# EAGLE design Stearns2 (EAGLE 6.6.0)
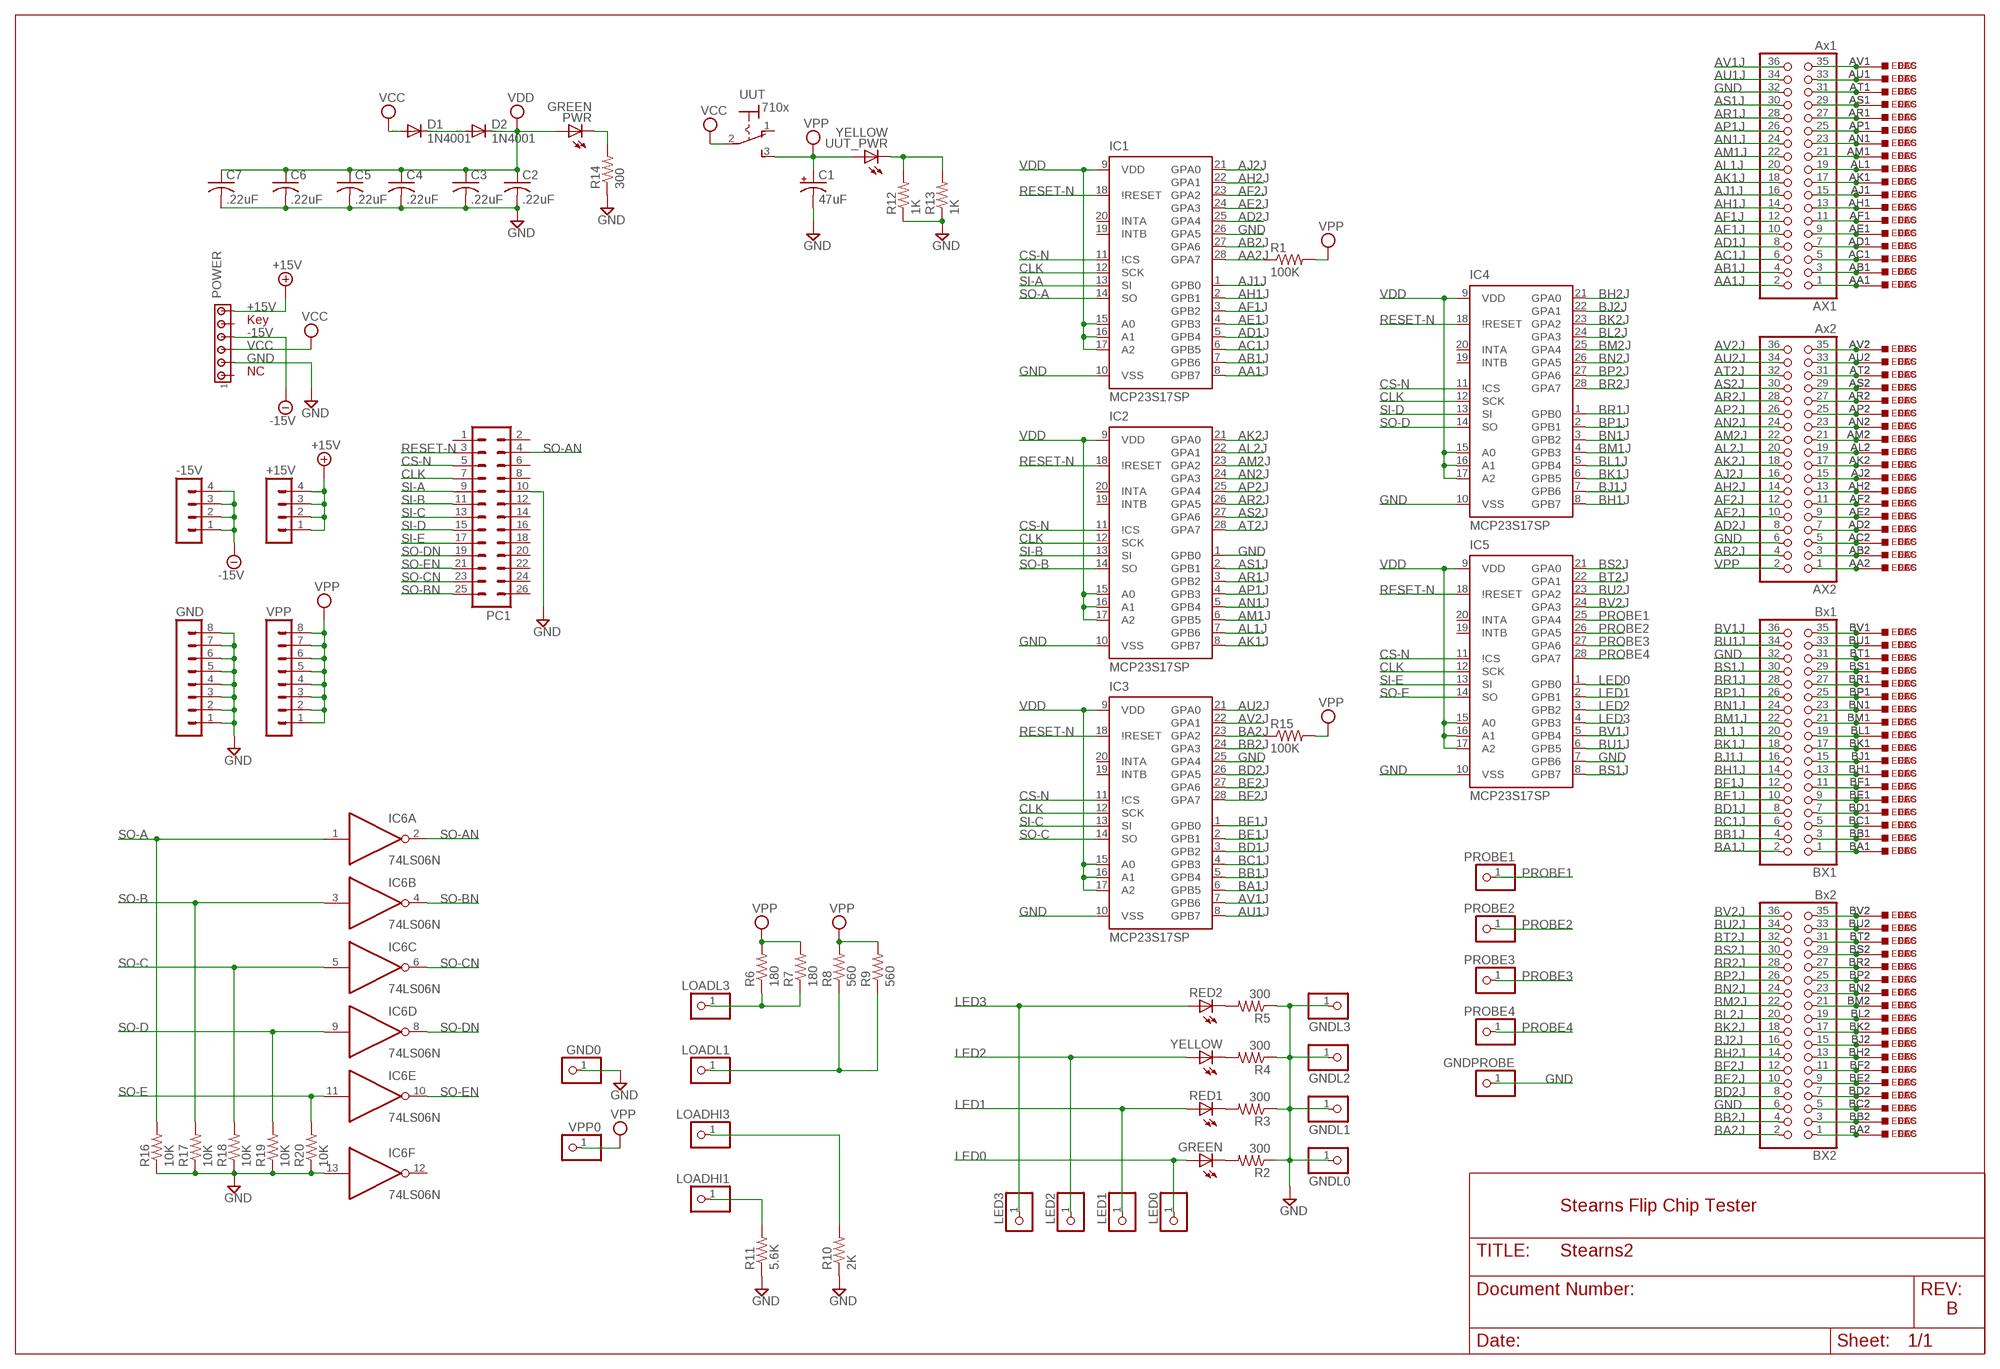
[diagram p0: schematic, sheet 1]

## Parts
+15V  MA04-1  [MA04-1]
-15V  MA04-1  [MA04-1]
AX1  Ax1  PINHD-2X18  [2X18]
AX2  Ax2  PINHD-2X18  [2X18]
BX1  Bx1  PINHD-2X18  [2X18]
BX2  Bx2  PINHD-2X18  [2X18]
C1  47uF  CPOL-USE5-8.5  [E5-8,5]
C2  .22uF  C-US050-025X075  [C050-025X075]
C3  .22uF  C-US050-025X075  [C050-025X075]
C4  .22uF  C-US050-025X075  [C050-025X075]
C5  .22uF  C-US050-025X075  [C050-025X075]
C6  .22uF  C-US050-025X075  [C050-025X075]
C7  .22uF  C-US050-025X075  [C050-025X075]
D1  1N4001  1N4004  [DO41-10]
D2  1N4001  1N4004  [DO41-10]
DEC  W971  [H807-2]
ECS  W971ECS  [ECS2418-2]
EDAC  W971EDAC  [EDAC346-36-2]
GND  MA08-1  [MA08-1]
GND0  PINHD-1X1  [1X01]
GNDL0  PINHD-1X1  [1X01]
GNDL1  PINHD-1X1  [1X01]
GNDL2  PINHD-1X1  [1X01]
GNDL3  PINHD-1X1  [1X01]
GNDPROBE  PINHD-1X1  [1X01]
GREEN  LED5MM  [LED5MM]
IC1  MCP23S17SP  [DIL28-3]
IC2  MCP23S17SP  [DIL28-3]
IC3  MCP23S17SP  [DIL28-3]
IC4  MCP23S17SP  [DIL28-3]
IC5  MCP23S17SP  [DIL28-3]
IC6  74LS06N  [DIL14]
LED0  PINHD-1X1  [1X01]
LED1  PINHD-1X1  [1X01]
LED2  PINHD-1X1  [1X01]
LED3  PINHD-1X1  [1X01]
LOADHI1  PINHD-1X1  [1X01]
LOADHI3  PINHD-1X1  [1X01]
LOADL1  PINHD-1X1  [1X01]
LOADL3  PINHD-1X1  [1X01]
PC1  MA13-2  [MA13-2]
POWER  MTA06-156  [1X6MTA]
PROBE1  PINHD-1X1  [1X01]
PROBE2  PINHD-1X1  [1X01]
PROBE3  PINHD-1X1  [1X01]
PROBE4  PINHD-1X1  [1X01]
PWR  GREEN  LED5MM  [LED5MM]
R1  100K  R-US_0207/10  [0207/10]
R2  300  R-US_0207/10  [0207/10]
R3  300  R-US_0207/10  [0207/10]
R4  300  R-US_0207/10  [0207/10]
R5  300  R-US_0207/10  [0207/10]
R6  180  R-US_0207/10  [0207/10]
R7  180  R-US_0207/10  [0207/10]
R8  560  R-US_0207/10  [0207/10]
R9  560  R-US_0207/10  [0207/10]
R10  2K  R-US_0207/10  [0207/10]
R11  5.6K  R-US_0207/10  [0207/10]
R12  1K  R-US_0207/10  [0207/10]
R13  1K  R-US_0207/10  [0207/10]
R14  300  R-US_0207/10  [0207/10]
R15  100K  R-US_0207/10  [0207/10]
R16  10K  R-US_0207/10  [0207/10]
R17  10K  R-US_0207/10  [0207/10]
R18  10K  R-US_0207/10  [0207/10]
R19  10K  R-US_0207/10  [0207/10]
R20  10K  R-US_0207/10  [0207/10]
RED1  LED5MM  [LED5MM]
RED2  LED5MM  [LED5MM]
UUT  710x  710X  [7109MD9V3]
UUT_PWR  YELLOW  LED5MM  [LED5MM]
VPP  MA08-1  [MA08-1]
VPP0  PINHD-1X1  [1X01]
YELLOW  LED5MM  [LED5MM]

## Nets
+15V [Supply]: +15V.1 +15V.2 +15V.3 +15V.4 POWER.6
-15V [Supply]: -15V.1 -15V.2 -15V.3 -15V.4 POWER.4
AA1J: AX1.2 IC1.8(GPB7)
AA2J: IC1.28(GPA7) R1.1
AB1J: AX1.4 IC1.7(GPB6)
AB2J: AX2.4 IC1.27(GPA6)
AC1J: AX1.6 IC1.6(GPB5)
AD1J: AX1.8 IC1.5(GPB4)
AD2J: AX2.8 IC1.25(GPA4)
AE1J: AX1.10 IC1.4(GPB3)
AE2J: AX2.10 IC1.24(GPA3)
AF1J: AX1.12 IC1.3(GPB2)
AF2J: AX2.12 IC1.23(GPA2)
AH1J: AX1.14 IC1.2(GPB1)
AH2J: AX2.14 IC1.22(GPA1)
AJ1J: AX1.16 IC1.1(GPB0)
AJ2J: AX2.16 IC1.21(GPA0)
AK1J: AX1.18 IC2.8(GPB7)
AK2J: AX2.18 IC2.21(GPA0)
AL1J: AX1.20 IC2.7(GPB6)
AL2J: AX2.20 IC2.22(GPA1)
AM1J: AX1.22 IC2.6(GPB5)
AM2J: AX2.22 IC2.23(GPA2)
AN1J: AX1.24 IC2.5(GPB4)
AN2J: AX2.24 IC2.24(GPA3)
AP1J: AX1.26 IC2.4(GPB3)
AP2J: AX2.26 IC2.25(GPA4)
AR1J: AX1.28 IC2.3(GPB2)
AR2J: AX2.28 IC2.26(GPA5)
AS1J: AX1.30 IC2.2(GPB1)
AS2J: AX2.30 IC2.27(GPA6)
AT2J: AX2.32 IC2.28(GPA7)
AU1J: AX1.34 IC3.8(GPB7)
AU2J: AX2.34 IC3.21(GPA0)
AV1J: AX1.36 IC3.7(GPB6)
AV2J: AX2.36 IC3.22(GPA1)
BA1J: BX1.2 IC3.6(GPB5)
BA2J [Supply]: BX2.2 IC3.23(GPA2) R15.1
BB1J: BX1.4 IC3.5(GPB4)
BB2J: BX2.4 IC3.24(GPA3)
BC1J: BX1.6 IC3.4(GPB3)
BD1J: BX1.8 IC3.3(GPB2)
BD2J: BX2.8 IC3.26(GPA5)
BE1J: BX1.10 IC3.2(GPB1)
BE2J: BX2.10 IC3.27(GPA6)
BF1J: BX1.12 IC3.1(GPB0)
BF2J: BX2.12 IC3.28(GPA7)
BH1J: BX1.14 IC4.8(GPB7)
BH2J: BX2.14 IC4.21(GPA0)
BJ1J: BX1.16 IC4.7(GPB6)
BJ2J: BX2.16 IC4.22(GPA1)
BK1J: BX1.18 IC4.6(GPB5)
BK2J: BX2.18 IC4.23(GPA2)
BL1J: BX1.20 IC4.5(GPB4)
BL2J: BX2.20 IC4.24(GPA3)
BM1J: BX1.22 IC4.4(GPB3)
BM2J: BX2.22 IC4.25(GPA4)
BN1J: BX1.24 IC4.3(GPB2)
BN2J: BX2.24 IC4.26(GPA5)
BP1J: BX1.26 IC4.2(GPB1)
BP2J: BX2.26 IC4.27(GPA6)
BR1J: BX1.28 IC4.1(GPB0)
BR2J: BX2.28 IC4.28(GPA7)
BS1J: BX1.30 IC5.8(GPB7)
BS2J: BX2.30 IC5.21(GPA0)
BT2J: BX2.32 IC5.22(GPA1)
BU1J: BX1.34 IC5.6(GPB5)
BU2J: BX2.34 IC5.23(GPA2)
BV1J: BX1.36 IC5.5(GPB4)
BV2J: BX2.36 IC5.24(GPA3)
CLK: IC1.12(SCK) IC2.12(SCK) IC3.12(SCK) IC4.12(SCK) IC5.12(SCK) PC1.7
CS-N: IC1.11(\!CS) IC2.11(\!CS) IC3.11(\!CS) IC4.11(\!CS) IC5.11(\!CS) PC1.5
GND [Supply]: AX1.32 AX2.6 BX1.32 BX2.6 C1.- C2.2 C3.2 C4.2 C5.2 C6.2 C7.2 GND0.1 GND.1 GND.2 GND.3 GND.4 GND.5 GND.6 GND.7 GND.8 GNDL0.1 GNDL1.1 GNDL2.1 GNDL3.1 GNDPROBE.1 IC1.10(VSS) IC1.26(GPA5) IC2.1(GPB0) IC2.10(VSS) IC3.10(VSS) IC3.25(GPA4) IC4.10(VSS) IC5.7(GPB6) IC5.10(VSS) IC6.13(F:I) PC1.10 POWER.2 R2.1 R3.1 R4.1 R5.1 R10.1 R11.1 R12.1 R13.1 R14.1 R16.1 R17.1 R18.1 R19.1 R20.1
LED0: GREEN.A IC5.1(GPB0) LED0.1
LED1: IC5.2(GPB1) LED1.1 RED1.A
LED2: IC5.3(GPB2) LED2.1 YELLOW.A
LED3: IC5.4(GPB3) LED3.1 RED2.A
N$1: AX1.1 DEC.AA1 ECS.AA1 EDAC.AA1
N$2: AX1.35 DEC.AV1 ECS.AV1 EDAC.AV1
N$3: AX1.33 DEC.AU1 ECS.AU1 EDAC.AU1
N$4: AX1.31 DEC.AT1 ECS.AT1 EDAC.AT1
N$5: AX1.29 DEC.AS1 ECS.AS1 EDAC.AS1
N$6: AX1.27 DEC.AR1 ECS.AR1 EDAC.AR1
N$7: AX1.25 DEC.AP1 ECS.AP1 EDAC.AP1
N$8: AX1.23 DEC.AN1 ECS.AN1 EDAC.AN1
N$9: AX1.21 DEC.AM1 ECS.AM1 EDAC.AM1
N$10: AX1.19 DEC.AL1 ECS.AL1 EDAC.AL1
N$11: AX1.17 DEC.AK1 ECS.AK1 EDAC.AK1
N$12: AX1.15 DEC.AJ1 ECS.AJ1 EDAC.AJ1
N$13: AX1.13 DEC.AH1 ECS.AH1 EDAC.AH1
N$14: AX1.11 DEC.AF1 ECS.AF1 EDAC.AF1
N$15: AX1.9 DEC.AE1 ECS.AE1 EDAC.AE1
N$16: AX1.7 DEC.AD1 ECS.AD1 EDAC.AD1
N$17: AX1.5 DEC.AC1 ECS.AC1 EDAC.AC1
N$18: AX1.3 DEC.AB1 ECS.AB1 EDAC.AB1
N$19: AX2.1 DEC.AA2 ECS.AA2 EDAC.AA2
N$20: AX2.3 DEC.AB2 ECS.AB2 EDAC.AB2
N$21: AX2.5 DEC.AC2 ECS.AC2 EDAC.AC2
N$22: AX2.7 DEC.AD2 ECS.AD2 EDAC.AD2
N$23: AX2.9 DEC.AE2 ECS.AE2 EDAC.AE2
N$24: AX2.11 DEC.AF2 ECS.AF2 EDAC.AF2
N$25: AX2.13 DEC.AH2 ECS.AH2 EDAC.AH2
N$26: AX2.15 DEC.AJ2 ECS.AJ2 EDAC.AJ2
N$27: AX2.17 DEC.AK2 ECS.AK2 EDAC.AK2
N$28: AX2.19 DEC.AL2 ECS.AL2 EDAC.AL2
N$29: AX2.21 DEC.AM2 ECS.AM2 EDAC.AM2
N$30: AX2.23 DEC.AN2 ECS.AN2 EDAC.AN2
N$31: AX2.25 DEC.AP2 ECS.AP2 EDAC.AP2
N$32: AX2.27 DEC.AR2 ECS.AR2 EDAC.AR2
N$33: AX2.29 DEC.AS2 ECS.AS2 EDAC.AS2
N$34: AX2.31 DEC.AT2 ECS.AT2 EDAC.AT2
N$35: AX2.33 DEC.AU2 ECS.AU2 EDAC.AU2
N$36: AX2.35 DEC.AV2 ECS.AV2 EDAC.AV2
N$37: BX2.1 DEC.BA2 ECS.BA2 EDAC.BA2
N$38: BX2.3 DEC.BB2 ECS.BB2 EDAC.BB2
N$39: BX2.5 DEC.BC2 ECS.BC2 EDAC.BC2
N$40: BX2.7 DEC.BD2 ECS.BD2 EDAC.BD2
N$41: BX2.9 DEC.BE2 ECS.BE2 EDAC.BE2
N$42: BX2.11 DEC.BF2 ECS.BF2 EDAC.BF2
N$43: BX2.13 DEC.BH2 ECS.BH2 EDAC.BH2
N$44: BX2.15 DEC.BJ2 ECS.BJ2 EDAC.BJ2
N$45: BX2.17 DEC.BK2 ECS.BK2 EDAC.BK2
N$46: BX2.19 DEC.BL2 ECS.BL2 EDAC.BL2
N$47: BX2.21 DEC.BM2 ECS.BM2 EDAC.BM2
N$48: BX2.23 DEC.BN2 ECS.BN2 EDAC.BN2
N$49: BX2.25 DEC.BP2 ECS.BP2 EDAC.BP2
N$50: BX2.27 DEC.BR2 ECS.BR2 EDAC.BR2
N$51: BX2.29 DEC.BS2 ECS.BS2 EDAC.BS2
N$52: BX2.31 DEC.BT2 ECS.BT2 EDAC.BT2
N$53: BX2.33 DEC.BU2 ECS.BU2 EDAC.BU2
N$54: BX2.35 DEC.BV2 ECS.BV2 EDAC.BV2
N$55: BX1.1 DEC.BA1 ECS.BA1 EDAC.BA1
N$56: BX1.3 DEC.BB1 ECS.BB1 EDAC.BB1
N$57: BX1.5 DEC.BC1 ECS.BC1 EDAC.BC1
N$58: BX1.7 DEC.BD1 ECS.BD1 EDAC.BD1
N$59: BX1.9 DEC.BE1 ECS.BE1 EDAC.BE1
N$60: BX1.11 DEC.BF1 ECS.BF1 EDAC.BF1
N$61: BX1.13 DEC.BH1 ECS.BH1 EDAC.BH1
N$62: BX1.15 DEC.BJ1 ECS.BJ1 EDAC.BJ1
N$63: BX1.17 DEC.BK1 ECS.BK1 EDAC.BK1
N$64: BX1.19 DEC.BL1 ECS.BL1 EDAC.BL1
N$65: BX1.21 DEC.BM1 ECS.BM1 EDAC.BM1
N$66: BX1.23 DEC.BN1 ECS.BN1 EDAC.BN1
N$67: BX1.25 DEC.BP1 ECS.BP1 EDAC.BP1
N$68: BX1.27 DEC.BR1 ECS.BR1 EDAC.BR1
N$69: BX1.29 DEC.BS1 ECS.BS1 EDAC.BS1
N$70: BX1.31 DEC.BT1 ECS.BT1 EDAC.BT1
N$71: BX1.33 DEC.BU1 ECS.BU1 EDAC.BU1
N$72: BX1.35 DEC.BV1 ECS.BV1 EDAC.BV1
N$73: GREEN.K(C) R2.2
N$74: R3.2 RED1.K(C)
N$75: R4.2 YELLOW.K(C)
N$76: R5.2 RED2.K(C)
N$77: LOADL3.1 R6.1 R7.1
N$78: LOADL1.1 R8.1 R9.1
N$79: LOADHI1.1 R11.2
N$80: LOADHI3.1 R10.2
N$81: D1.C D2.A
N$82: R12.2 R13.2 UUT_PWR.K(C)
N$83: PWR.K(C) R14.2
PROBE1: IC5.25(GPA4) PROBE1.1
PROBE2: IC5.26(GPA5) PROBE2.1
PROBE3: IC5.27(GPA6) PROBE3.1
PROBE4: IC5.28(GPA7) PROBE4.1
RESET-N: IC1.18(\!RESET) IC2.18(\!RESET) IC3.18(\!RESET) IC4.18(\!RESET) IC5.18(\!RESET) PC1.3
SI-A: IC1.13(SI) PC1.9
SI-B: IC2.13(SI) PC1.11
SI-C: IC3.13(SI) PC1.13
SI-D: IC4.13(SI) PC1.15
SI-E: IC5.13(SI) PC1.17
SO-A: IC1.14(SO) IC6.1(A:I) R16.2
SO-AN: IC6.2(A:O) PC1.4
SO-B: IC2.14(SO) IC6.3(B:I) R17.2
SO-BN: IC6.4(B:O) PC1.25
SO-C: IC3.14(SO) IC6.5(C:I) R18.2
SO-CN: IC6.6(C:O) PC1.23
SO-D: IC4.14(SO) IC6.9(D:I) R19.2
SO-DN: IC6.8(D:O) PC1.19
SO-E: IC5.14(SO) IC6.11(E:I) R20.2
SO-EN: IC6.10(E:O) PC1.21
VCC [Supply]: D1.A POWER.3 UUT.2(P)
VDD [Supply]: C2.1 C3.1 C4.1 C5.1 C6.1 C7.1 D2.C IC1.9(VDD) IC1.15(A0) IC1.16(A1) IC1.17(A2) IC2.9(VDD) IC2.15(A0) IC2.16(A1) IC2.17(A2) IC3.9(VDD) IC3.15(A0) IC3.16(A1) IC3.17(A2) IC4.9(VDD) IC4.15(A0) IC4.16(A1) IC4.17(A2) IC5.9(VDD) IC5.15(A0) IC5.16(A1) IC5.17(A2) PWR.A
VPP [Supply]: AX2.2 C1.+ R1.2 R6.2 R7.2 R8.2 R9.2 R15.2 UUT.3(S) UUT_PWR.A VPP0.1 VPP.1 VPP.2 VPP.3 VPP.4 VPP.5 VPP.6 VPP.7 VPP.8
Unconnected: IC1.19(INTB) IC1.20(INTA) IC2.19(INTB) IC2.20(INTA) IC3.19(INTB) IC3.20(INTA) IC4.19(INTB) IC4.20(INTA) IC5.19(INTB) IC5.20(INTA) IC6.12(F:O) PC1.1 PC1.2 PC1.6 PC1.8 PC1.12 PC1.14 PC1.16 PC1.18 PC1.20 PC1.22 PC1.24 PC1.26 POWER.1 POWER.5 UUT.1(O)

## Notes on the sheet
- Key
- NC
- Stearns Flip Chip Tester
- B

## Power pins joined to a net without a drawn wire
GND: IC6.7(P:GND) UUT.NC@1(GND) UUT.NC@2(GND) UUT.NC@3(GND) UUT.NC@4(GND) UUT.NC@5(GND) UUT.NC@6(GND) UUT.NC@7(GND) UUT.NC@8(GND)
VCC: IC6.14(P:VCC)

## Library data of the parts
+15V -15V = con-lstb:MA04-1: PIN HEADER; OC_FARNELL: unknown; OC_NEWARK: unknown
AX1 AX2 BX1 BX2 = pinhead:PINHD-2X18: PIN HEADER
C1 = rcl:CPOL-US: POLARIZED CAPACITOR, American symbol
C2-C7 = rcl:C-US: CAPACITOR, American symbol
D1 D2 = diode:1N4004: DIODE general purpose rectifier, 1 A
DEC ECS EDAC = dec-m:W971: Double sided Double Height Connector, 72 pins
GND VPP = con-lstb:MA08-1: PIN HEADER; OC_FARNELL: unknown; OC_NEWARK: unknown
GND0 GNDL0 GNDL1-GNDL3 GNDPROBE LED0 LED1-LED3 LOADHI1 LOADHI3 LOADL1 LOADL3 PROBE1-PROBE4 VPP0 = pinhead:PINHD-1X1: PIN HEADER
GREEN PWR RED1 RED2 UUT_PWR YELLOW = led:LED: LED OSRAM: - CHIPLED LG R971, LG N971, LY N971, LG Q971, LY Q971, LO R971, LY R971 LH N974, LH R974 LS Q976, LO Q976, LY Q976 LO Q996 - Hyper CHIPLED LW Q18S LB Q993, LB Q99A, LB R99A - SideLED LS A670, LO A670, LY A670, LG A670, LP A670 LB A673, LV A673, LT A673, LW A673 LH A674 LY A675 LS A676, LA A676, LO A676, LY A676, LW A676 LS A679, LY A679, LG A679 - Hyper Micro SIDELED® LS Y876, LA Y876, LO Y876, LY Y876 LT Y87S - SmartLED LW L88C, LW L88S LB L89C, LB L89S, LG L890 LS L89K, LO L89K, LY L89K LS L896, LA L896, LO L896, LY L896 - TOPLED LS T670, LO T670, LY T670, LG T670, LP T670 LSG T670, LSP T670, LSY T670, LOP T670, LYG T670 LG T671, LOG T671, LSG T671 LB T673, LV T673, LT T673, LW T673 LH T674 LS T676, LA T676, LO T676, LY T676, LB T676, LH T676, LSB T676, LW T676 LB T67C, LV T67C, LT T67C, LS T67K, LO T67K, LY T67K, LW E67C LS E67B, LA E67B, LO E67B, LY E67B, LB E67C, LV E67C, LT E67C LW T67C LS T679, LY T679, LG T679 LS T770, LO T770, LY T770, LG T770, LP T770 LB T773, LV T773, LT T773, LW T773 LH T774 LS E675, LA E675, LY E675, LS T675 LS T776, LA T776, LO T776, LY T776, LB T776 LHGB T686 LT T68C, LB T68C - Hyper Mini TOPLED® LB M676 - Mini TOPLED Santana® LG M470 LS M47K, LO M47K, LY M47K Source: http://www.osram.convergy.de LUXEON: - LUMILED® LXK2-PW12-R00, LXK2-PW12-S00, LXK2-PW14-U00, LXK2-PW14-V00 LXK2-PM12-R00, LXK2-PM12-S00, LXK2-PM14-U00 LXK2-PE12-Q00, LXK2-PE12-R00, LXK2-PE12-S00, LXK2-PE14-T00, LXK2-PE14-U00 LXK2-PB12-K00, LXK2-PB12-L00, LXK2-PB12-M00, LXK2-PB14-N00, LXK2-PB14-P00, LXK2-PB14-Q00 LXK2-PR12-L00, LXK2-PR12-M00, LXK2-PR14-Q00, LXK2-PR14-R00 LXK2-PD12-Q00, LXK2-PD12-R00, LXK2-PD12-S00 LXK2-PH12-R00, LXK2-PH12-S00 LXK2-PL12-P00, LXK2-PL12-Q00, LXK2-PL12-R00 Source: www.luxeon.com KINGBRIGHT: KA-3528ASYC Source: www.kingbright.com
IC1-IC5 = MCP23S17:MCP23S17: http://ww1.microchip.com/downloads/en/DeviceDoc/21952a.pdf Source: http://ww1.microchip.com/downloads/en/DeviceDoc/21952a.pdf
IC6 = 74xx-us:74*06: Hex INVERTER, open collector high-voltage output
PC1 = con-lstb:MA13-2: PIN HEADER; OC_FARNELL: unknown; OC_NEWARK: unknown
POWER = con-amp:MTA06-156: AMP connector
R1-R20 = rcl:R-US_: RESISTOR, American symbol
UUT = dec-con:710X: 710x with optional V2 or V3 mounting bracket.

## Net classes
1 Supply: width 0.813 mm

## Board
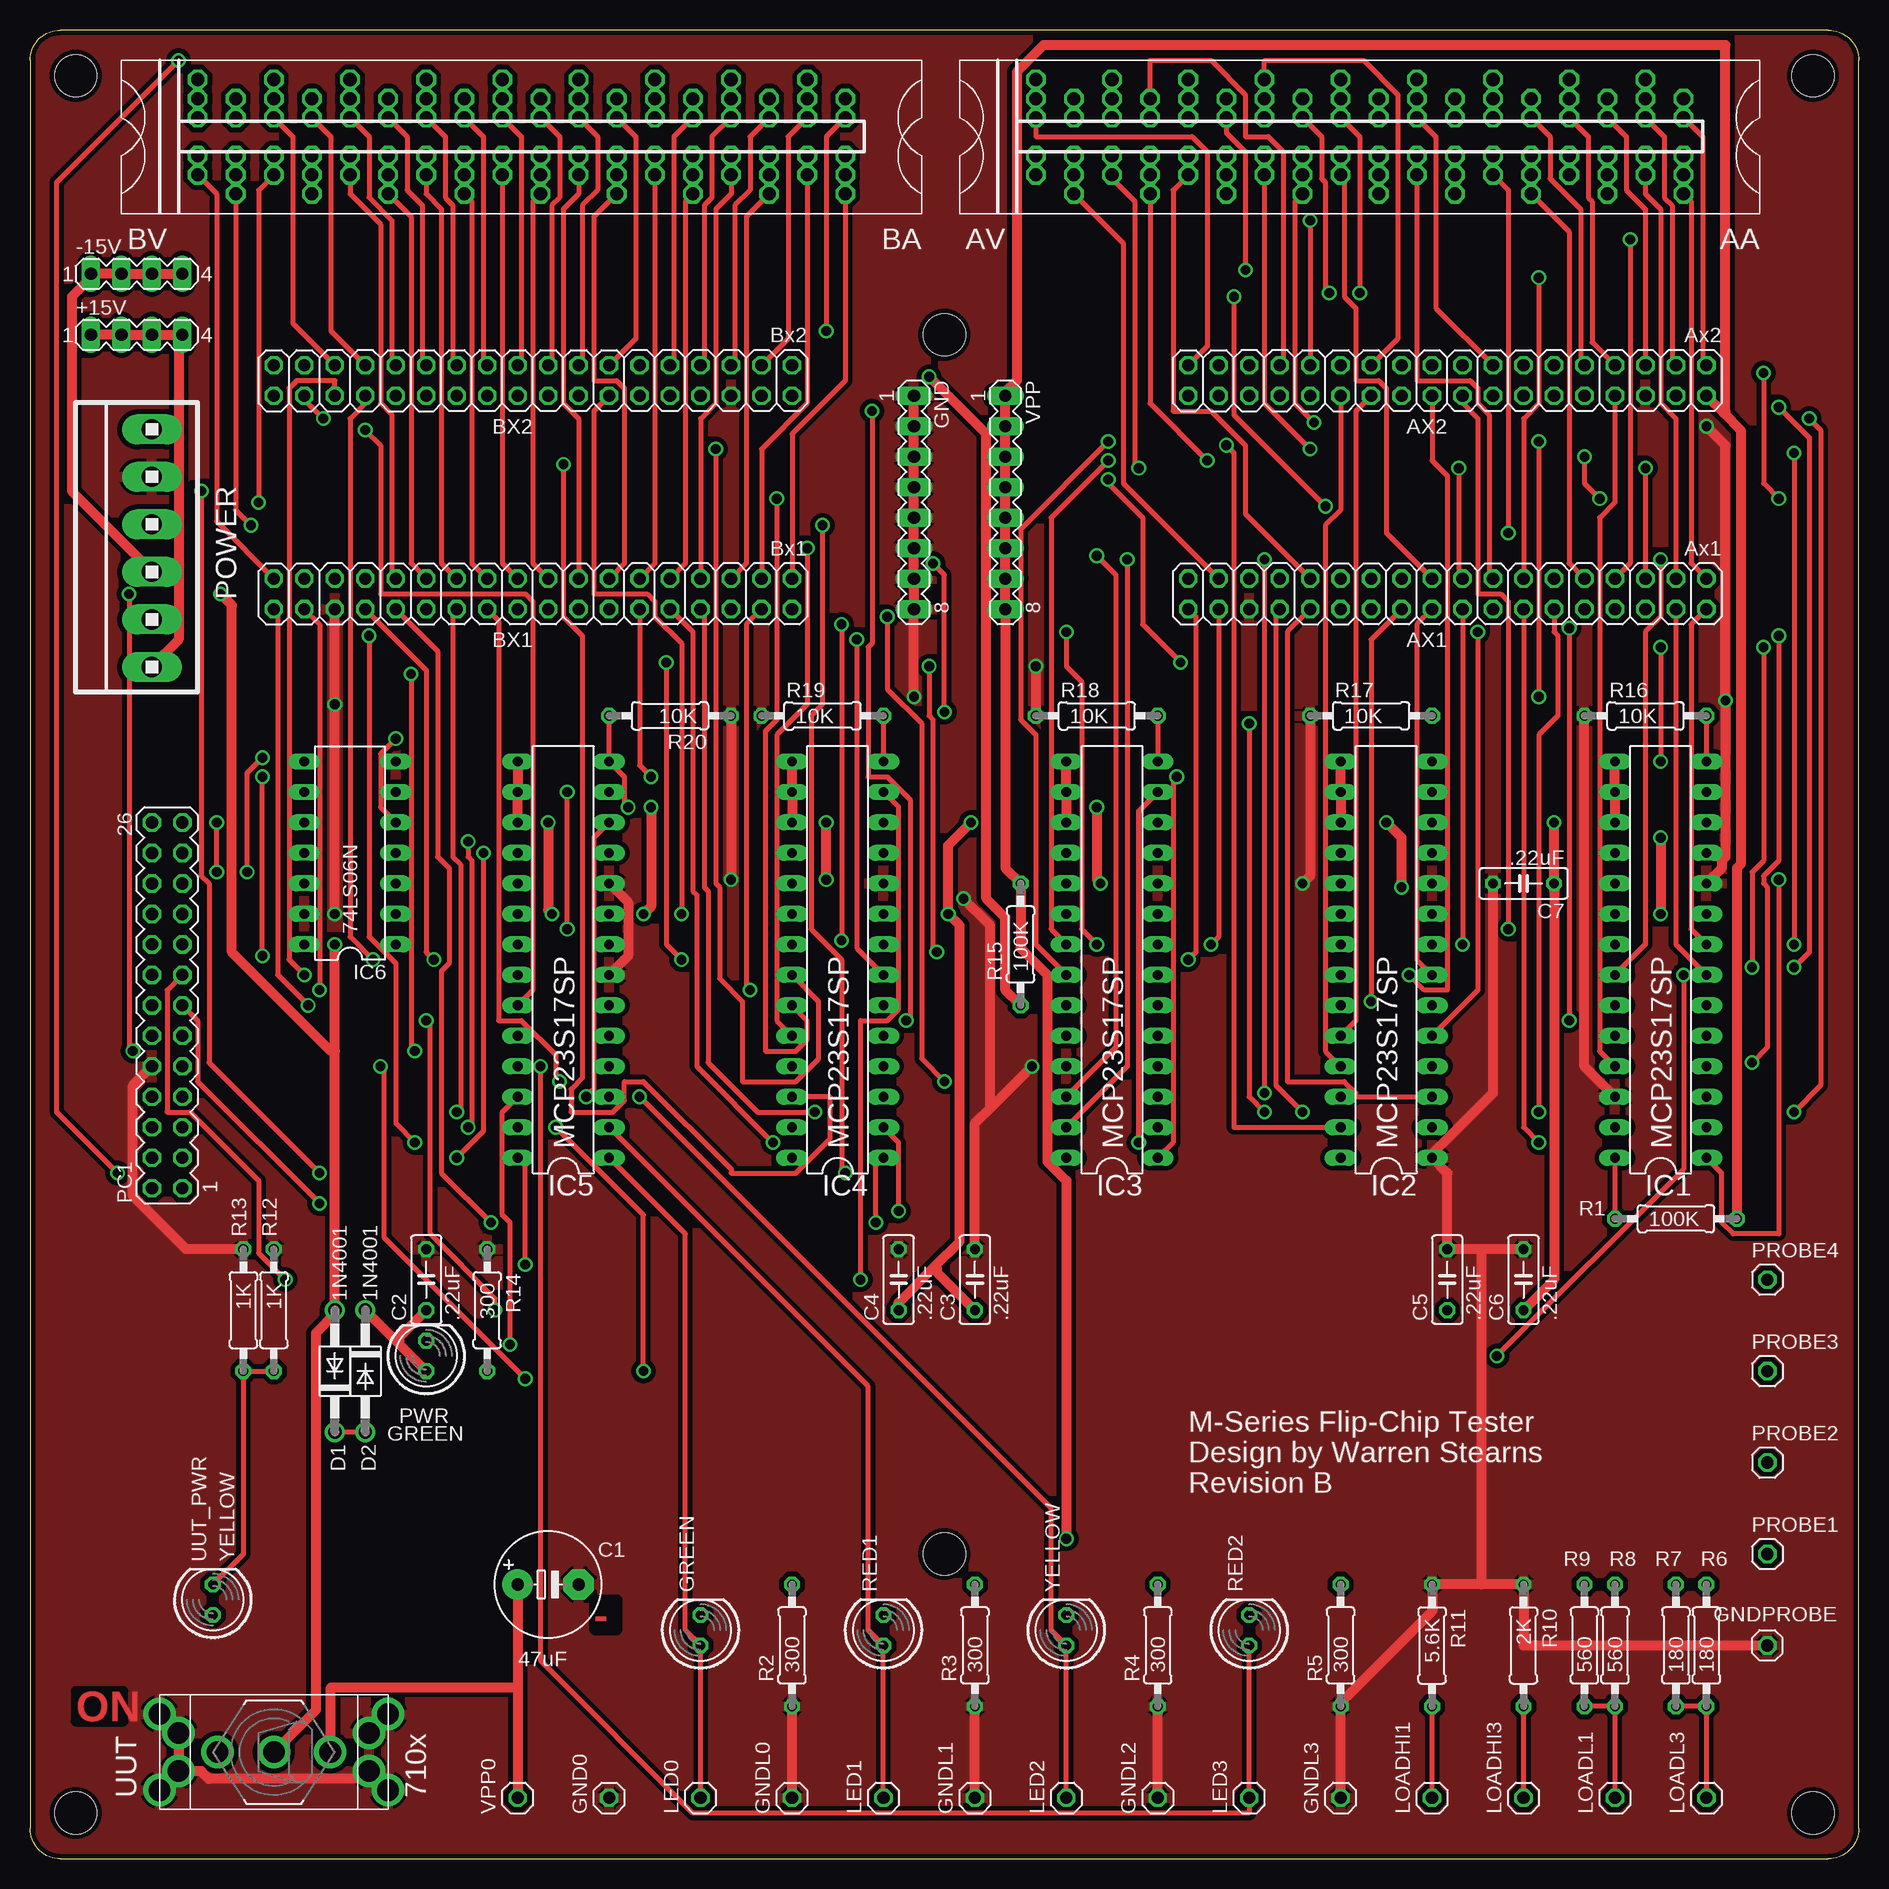
[diagram p1: board, top side]
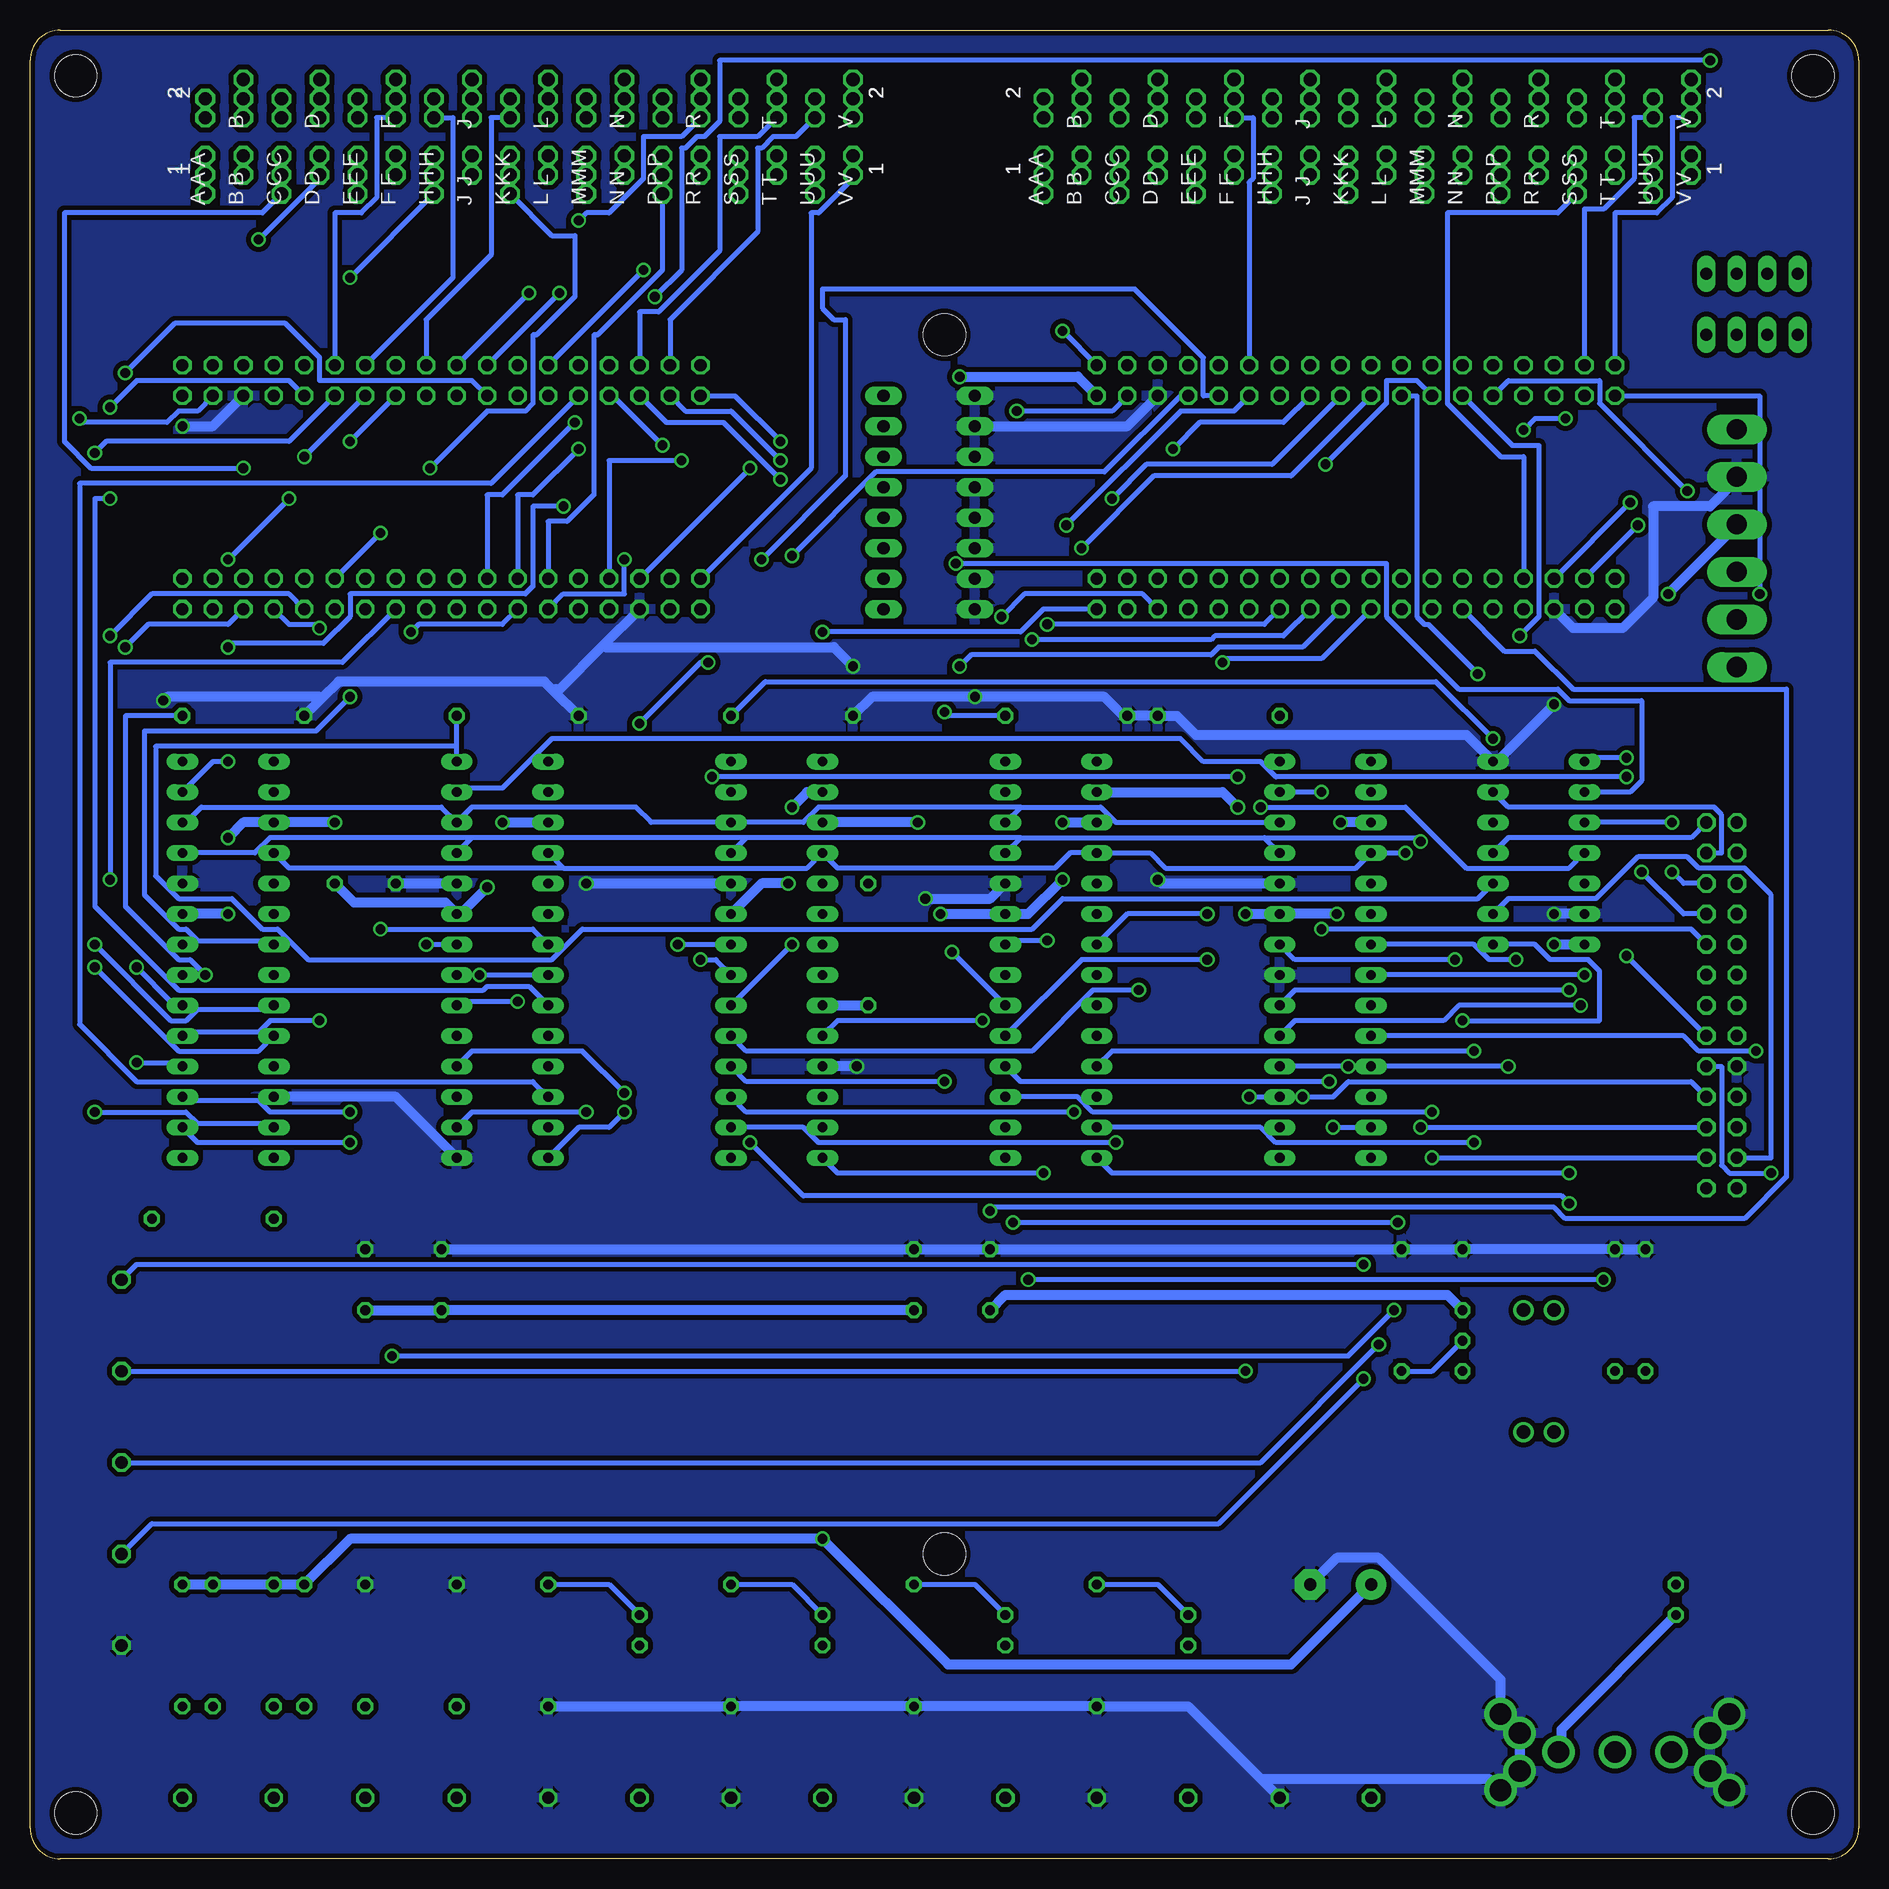
[diagram p2: board, bottom side, seen from below]

Size 152.4 x 152.4 mm. Coordinates in mm from the lower left corner, seen from the top.
Outline: 149.86,152.4 2.54,152.4 arc90 0,149.86 0,2.54 arc90 2.54,0 149.86,0 arc90 152.4,2.54 152.4,149.86 arc90 149.86,152.4
Copper layers (1+16): Top 0.035mm / dielectric 1.5mm / Bottom 0.035mm
Design rules "16mils *": minimum track width 16mil, minimum drill 32mil, track to track 15mil, track to pad 10mil, pad to pad 10mil, via to via 10mil, smd to smd 10mil, copper to edge 13mil, drill to drill 10mil, minimum pad ring 10mil, minimum via ring 8mil, stop-mask expansion 0mil, vias tented up to drill 0mil, thermal gap 10mil
Holes 3.51 mm at 148.59,148.59 3.81,148.59 3.81,3.81 148.59,3.81 76.2,127 76.2,25.4

### Footprints (pad centres in the part's own frame; a part is rotated, then mirrored left to right if it is on the bottom)
MA04-1 = drill 1.016 long: 1 -3.81,0; 2 -1.27,0; 3 1.27,0; 4 3.81,0
2X18 = drill 1.016 octagon: 1 -21.59,-1.27; 2 -21.59,1.27; 3 -19.05,-1.27; 4 -19.05,1.27; 5 -16.51,-1.27; 6 -16.51,1.27; 7 -13.97,-1.27; 8 -13.97,1.27; 9 -11.43,-1.27; 10 -11.43,1.27; 11 -8.89,-1.27; 12 -8.89,1.27; 13 -6.35,-1.27; 14 -6.35,1.27; 15 -3.81,-1.27; 16 -3.81,1.27; 17 -1.27,-1.27; 18 -1.27,1.27; 19 1.27,-1.27; 20 1.27,1.27; 21 3.81,-1.27; 22 3.81,1.27; 23 6.35,-1.27; 24 6.35,1.27; 25 8.89,-1.27; 26 8.89,1.27; 27 11.43,-1.27; 28 11.43,1.27; 29 13.97,-1.27; 30 13.97,1.27; 31 16.51,-1.27; 32 16.51,1.27; 33 19.05,-1.27; 34 19.05,1.27; 35 21.59,-1.27; 36 21.59,1.27
E5-8,5 = drill 1.016 pad 2.54: + -2.54,0 | drill 1.016 pad 2.54 octagon: - 2.54,0
C050-025X075 = drill 0.813 octagon: 1 -2.54,0; 2 2.54,0
DO41-10 = drill 1.118: A 5.08,0; C -5.08,0
H807-2 = drill 1.092 octagon: AA1 4.763,60.325; AA2 -1.587,60.325; AB1 1.587,57.15; AB2 -4.763,57.15; AC1 4.763,53.975; AC2 -1.587,53.975; AD1 1.587,50.8; AD2 -4.763,50.8; AE1 4.763,47.625; AE2 -1.587,47.625; AF1 1.587,44.45; AF2 -4.763,44.45; AH1 4.763,41.275; AH2 -1.587,41.275; AJ1 1.587,38.1; AJ2 -4.763,38.1; AK1 4.763,34.925; AK2 -1.587,34.925; AL1 1.587,31.75; AL2 -4.763,31.75; AM1 4.763,28.575; AM2 -1.587,28.575; AN1 1.587,25.4; AN2 -4.763,25.4; AP1 4.763,22.225; AP2 -1.587,22.225; AR1 1.587,19.05; AR2 -4.763,19.05; AS1 4.763,15.875; AS2 -1.587,15.875; AT1 1.587,12.7; AT2 -4.763,12.7; AU1 4.763,9.525; AU2 -1.587,9.525; AV1 1.587,6.35; AV2 -4.763,6.35; BA1 4.763,-9.525; BA2 -1.587,-9.525; BB1 1.587,-12.7; BB2 -4.763,-12.7; BC1 4.763,-15.875; BC2 -1.587,-15.875; BD1 1.587,-19.05; BD2 -4.763,-19.05; BE1 4.763,-22.225; BE2 -1.587,-22.225; BF1 1.587,-25.4; BF2 -4.763,-25.4; BH1 4.763,-28.575; BH2 -1.587,-28.575; BJ1 1.587,-31.75; BJ2 -4.763,-31.75; BK1 4.763,-34.925; BK2 -1.587,-34.925; BL1 1.587,-38.1; BL2 -4.763,-38.1; BM1 4.763,-41.275; BM2 -1.587,-41.275; BN1 1.587,-44.45; BN2 -4.763,-44.45; BP1 4.763,-47.625; BP2 -1.587,-47.625; BR1 1.587,-50.8; BR2 -4.763,-50.8; BS1 4.763,-53.975; BS2 -1.587,-53.975; BT1 1.587,-57.15; BT2 -4.763,-57.15; BU1 4.763,-60.325; BU2 -1.587,-60.325; BV1 1.587,-63.5; BV2 -4.763,-63.5
ECS2418-2 = drill 1.092 octagon: AA1 1.587,60.325; AA2 -1.587,60.325; AB1 1.587,57.15; AB2 -1.587,57.15; AC1 1.587,53.975; AC2 -1.587,53.975; AD1 1.587,50.8; AD2 -1.587,50.8; AE1 1.587,47.625; AE2 -1.587,47.625; AF1 1.587,44.45; AF2 -1.587,44.45; AH1 1.587,41.275; AH2 -1.587,41.275; AJ1 1.587,38.1; AJ2 -1.587,38.1; AK1 1.587,34.925; AK2 -1.587,34.925; AL1 1.587,31.75; AL2 -1.587,31.75; AM1 1.587,28.575; AM2 -1.587,28.575; AN1 1.587,25.4; AN2 -1.587,25.4; AP1 1.587,22.225; AP2 -1.587,22.225; AR1 1.587,19.05; AR2 -1.587,19.05; AS1 1.587,15.875; AS2 -1.587,15.875; AT1 1.587,12.7; AT2 -1.587,12.7; AU1 1.587,9.525; AU2 -1.587,9.525; AV1 1.587,6.35; AV2 -1.587,6.35; BA1 1.587,-9.525; BA2 -1.587,-9.525; BB1 1.587,-12.7; BB2 -1.587,-12.7; BC1 1.587,-15.875; BC2 -1.587,-15.875; BD1 1.587,-19.05; BD2 -1.587,-19.05; BE1 1.587,-22.225; BE2 -1.587,-22.225; BF1 1.587,-25.4; BF2 -1.587,-25.4; BH1 1.587,-28.575; BH2 -1.587,-28.575; BJ1 1.587,-31.75; BJ2 -1.587,-31.75; BK1 1.587,-34.925; BK2 -1.587,-34.925; BL1 1.587,-38.1; BL2 -1.587,-38.1; BM1 1.587,-41.275; BM2 -1.587,-41.275; BN1 1.587,-44.45; BN2 -1.587,-44.45; BP1 1.587,-47.625; BP2 -1.587,-47.625; BR1 1.587,-50.8; BR2 -1.587,-50.8; BS1 1.587,-53.975; BS2 -1.587,-53.975; BT1 1.587,-57.15; BT2 -1.587,-57.15; BU1 1.587,-60.325; BU2 -1.587,-60.325; BV1 1.587,-63.5; BV2 -1.587,-63.5
EDAC346-36-2 = drill 1.092 octagon: AA1 3.175,60.325; AA2 -3.175,60.325; AB1 3.175,57.15; AB2 -3.175,57.15; AC1 3.175,53.975; AC2 -3.175,53.975; AD1 3.175,50.8; AD2 -3.175,50.8; AE1 3.175,47.625; AE2 -3.175,47.625; AF1 3.175,44.45; AF2 -3.175,44.45; AH1 3.175,41.275; AH2 -3.175,41.275; AJ1 3.175,38.1; AJ2 -3.175,38.1; AK1 3.175,34.925; AK2 -3.175,34.925; AL1 3.175,31.75; AL2 -3.175,31.75; AM1 3.175,28.575; AM2 -3.175,28.575; AN1 3.175,25.4; AN2 -3.175,25.4; AP1 3.175,22.225; AP2 -3.175,22.225; AR1 3.175,19.05; AR2 -3.175,19.05; AS1 3.175,15.875; AS2 -3.175,15.875; AT1 3.175,12.7; AT2 -3.175,12.7; AU1 3.175,9.525; AU2 -3.175,9.525; AV1 3.175,6.35; AV2 -3.175,6.35; BA1 3.175,-9.525; BA2 -3.175,-9.525; BB1 3.175,-12.7; BB2 -3.175,-12.7; BC1 3.175,-15.875; BC2 -3.175,-15.875; BD1 3.175,-19.05; BD2 -3.175,-19.05; BE1 3.175,-22.225; BE2 -3.175,-22.225; BF1 3.175,-25.4; BF2 -3.175,-25.4; BH1 3.175,-28.575; BH2 -3.175,-28.575; BJ1 3.175,-31.75; BJ2 -3.175,-31.75; BK1 3.175,-34.925; BK2 -3.175,-34.925; BL1 3.175,-38.1; BL2 -3.175,-38.1; BM1 3.175,-41.275; BM2 -3.175,-41.275; BN1 3.175,-44.45; BN2 -3.175,-44.45; BP1 3.175,-47.625; BP2 -3.175,-47.625; BR1 3.175,-50.8; BR2 -3.175,-50.8; BS1 3.175,-53.975; BS2 -3.175,-53.975; BT1 3.175,-57.15; BT2 -3.175,-57.15; BU1 3.175,-60.325; BU2 -3.175,-60.325; BV1 3.175,-63.5; BV2 -3.175,-63.5
MA08-1 = drill 1.016 long: 1 -8.89,0; 2 -6.35,0; 3 -3.81,0; 4 -1.27,0; 5 1.27,0; 6 3.81,0; 7 6.35,0; 8 8.89,0
1X01 = drill 1.016 octagon: 1 0,0
LED5MM = drill 0.813 octagon: A -1.27,0; K 1.27,0
DIL28-3 = drill 0.813 long: 1 -16.51,-3.81; 2 -13.97,-3.81; 3 -11.43,-3.81; 4 -8.89,-3.81; 5 -6.35,-3.81; 6 -3.81,-3.81; 7 -1.27,-3.81; 8 1.27,-3.81; 9 3.81,-3.81; 10 6.35,-3.81; 11 8.89,-3.81; 12 11.43,-3.81; 13 13.97,-3.81; 14 16.51,-3.81; 15 16.51,3.81; 16 13.97,3.81; 17 11.43,3.81; 18 8.89,3.81; 19 6.35,3.81; 20 3.81,3.81; 21 1.27,3.81; 22 -1.27,3.81; 23 -3.81,3.81; 24 -6.35,3.81; 25 -8.89,3.81; 26 -11.43,3.81; 27 -13.97,3.81; 28 -16.51,3.81
DIL14 = drill 0.813 long: 1 -7.62,-3.81; 2 -5.08,-3.81; 3 -2.54,-3.81; 4 0,-3.81; 5 2.54,-3.81; 6 5.08,-3.81; 7 7.62,-3.81; 8 7.62,3.81; 9 5.08,3.81; 10 2.54,3.81; 11 0,3.81; 12 -2.54,3.81; 13 -5.08,3.81; 14 -7.62,3.81
MA13-2 = drill 1.016 octagon: 1 -15.24,-1.27; 2 -15.24,1.27; 3 -12.7,-1.27; 4 -12.7,1.27; 5 -10.16,-1.27; 6 -10.16,1.27; 7 -7.62,-1.27; 8 -7.62,1.27; 9 -5.08,-1.27; 10 -5.08,1.27; 11 -2.54,-1.27; 12 -2.54,1.27; 13 0,-1.27; 14 0,1.27; 15 2.54,-1.27; 16 2.54,1.27; 17 5.08,-1.27; 18 5.08,1.27; 19 7.62,-1.27; 20 7.62,1.27; 21 10.16,-1.27; 22 10.16,1.27; 23 12.7,-1.27; 24 12.7,1.27; 25 15.24,-1.27; 26 15.24,1.27
1X6MTA = drill 1.676 long: 1 9.906,0; 2 5.944,0; 3 1.981,0; 4 -1.981,0; 5 -5.944,0; 6 -9.906,0
0207/10 = drill 0.813 octagon: 1 -5.08,0; 2 5.08,0
7109MD9V3 = drill 1.803: 1 0,4.699; 2 0,0; 3 0,-4.699; NC@1 -3.175,9.525; NC@2 -1.587,7.938; NC@3 3.175,9.525; NC@4 1.587,7.938; NC@5 -3.175,-9.525; NC@6 -1.587,-7.938; NC@7 1.587,-7.938; NC@8 3.175,-9.525

### Placement (x,y rotation side)
+15V  8.89,127 0 top
-15V  8.89,132.08 0 top
AX1  118.11,105.41 180 top
AX2  118.11,123.19 180 top
BX1  41.91,105.41 180 top
BX2  41.91,123.19 180 top
C1  43.18,22.86 0 top
C2  33.02,48.26 90 top
C3  78.74,48.26 90 top
C4  72.39,48.26 90 top
C5  118.11,48.26 90 top
C6  124.46,48.26 90 top
C7  124.46,81.28 180 top
D1  25.4,40.64 90 top
D2  27.94,40.64 270 top
DEC  77.47,143.51 270 top
ECS  77.47,143.51 270 top
EDAC  77.47,143.51 270 top
GND  73.66,113.03 270 top
GND0  48.26,5.08 90 top
GNDL0  63.5,5.08 90 top
GNDL1  78.74,5.08 90 top
GNDL2  93.98,5.08 90 top
GNDL3  109.22,5.08 90 top
GNDPROBE  144.78,17.78 180 top
GREEN  55.88,19.05 90 top
IC1  135.89,74.93 90 top
IC2  113.03,74.93 90 top
IC3  90.17,74.93 90 top
IC4  67.31,74.93 90 top
IC5  44.45,74.93 90 top
IC6  26.67,83.82 90 top
LED0  55.88,5.08 90 top
LED1  71.12,5.08 90 top
LED2  86.36,5.08 90 top
LED3  101.6,5.08 90 top
LOADHI1  116.84,5.08 90 top
LOADHI3  124.46,5.08 90 top
LOADL1  132.08,5.08 90 top
LOADL3  139.7,5.08 90 top
PC1  11.43,71.12 90 top
POWER  10.16,109.22 90 top
PROBE1  144.78,25.4 0 top
PROBE2  144.78,33.02 0 top
PROBE3  144.78,40.64 0 top
PROBE4  144.78,48.26 0 top
PWR  33.02,41.91 90 top
R1  137.16,53.34 0 top
R2  63.5,17.78 90 top
R3  78.74,17.78 90 top
R4  93.98,17.78 90 top
R5  109.22,17.78 90 top
R6  139.7,17.78 90 top
R7  137.16,17.78 90 top
R8  132.08,17.78 90 top
R9  129.54,17.78 90 top
R10  124.46,17.78 270 top
R11  116.84,17.78 270 top
R12  20.32,45.72 270 top
R13  17.78,45.72 270 top
R14  38.1,45.72 270 top
R15  82.55,76.2 90 top
R16  134.62,95.25 0 top
R17  111.76,95.25 0 top
R18  88.9,95.25 0 top
R19  66.04,95.25 0 top
R20  53.34,95.25 180 top
RED1  71.12,19.05 90 top
RED2  101.6,19.05 90 top
UUT  20.32,8.89 90 top
UUT_PWR  15.24,21.59 90 top
VPP  81.28,113.03 270 top
VPP0  40.64,5.08 90 top
YELLOW  86.36,19.05 90 top

### Tracks (layer width: path | path; a pad name or v marks a point on that pad's centre or on a via)
+15V
  Top 0.813: +15V.1 +15V.2 +15V.3 +15V.4 12.38,126.68 12.38,101.6 10.16,99.38 POWER.6
-15V
  Top 0.813: -15V.4 -15V.3 -15V.2 -15V.1 5.08,131.76 3.49,130.18 3.49,113.98 10.16,107.31 POWER.4
AA1J
  Top 0.406: IC1.8 138.43,77.47 138.43,102.87 AX1.2
AA2J
  Top 0.406: IC1.28 R1.1
AB1J
  Top 0.406: IC1.7 137.16,76.2 AX1.4
AB2J  (via drill 0.81)
  Top 0.406: v147,62.23 149.22,64.45 149.22,119.06 v148.27,120.02
  Bottom 0.406: IC1.27 132.4,61.28 138.43,61.28 139.38,62.23 v147,62.23 | v148.27,120.02 147.96,119.7 140.97,119.7 140.02,120.65 138.43,120.65 AX2.4
AC1J  (via drill 0.81)
  Top 0.406: v143.51,74.3 143.51,82.23 144.46,83.19 v144.46,100.97
  Bottom 0.406: IC1.6 140.02,71.44 140.65,71.44 v143.51,74.3 | v144.46,100.97 142.56,102.87 135.89,102.87 AX1.6
AD1J  (via drill 0.81)
  Top 0.406: v128.27,102.55 v128.27,69.85
  Bottom 0.406: IC1.5 139.38,68.9 133.35,68.9 132.4,69.85 v128.27,69.85 | v128.27,102.55 128.59,102.87 130.81,102.87 AX1.8
AD2J
  Top 0.406: IC1.25 130.81,67.31 130.81,111.76 132.08,113.03 AX2.8
AE1J  (via drill 0.81)
  Top 0.406: v143.51,66.36 144.78,67.63 144.78,80.96 144.46,81.28 144.46,81.92 145.73,83.19 v145.73,101.92
  Bottom 0.406: IC1.4 140.02,66.36 v143.51,66.36 | v145.73,101.92 142.24,105.41 130.81,105.41 AX1.10
AE2J  (via drill 0.81)
  Top 0.406: v147,74.3 148.27,75.56 148.27,118.43 v145.73,120.97
  Bottom 0.406: IC1.24 133.35,67.31 140.02,67.31 v147,74.3 | v145.73,120.97 143.51,123.19 130.81,123.19 AX2.10
AF1J  (via drill 0.81)
  Top 0.406: v125.73,62.23 125.73,93.66 127.32,95.25 127.32,101.92 127,102.23 AX1.12
  Bottom 0.406: IC1.3 139.38,63.18 133.35,63.18 132.4,62.23 v125.73,62.23
AF2J  (via drill 0.81)
  Top 0.406: v147,117.16 v147,76.2
  Bottom 0.406: IC1.23 132.4,70.8 138.43,70.8 139.38,69.85 140.65,69.85 v147,76.2 | v147,117.16 146.05,118.11 130.81,118.11 AX2.12
AH1J  (via drill 0.81)
  Top 0.406: v125.73,59.69 124.46,60.96 AX1.14
  Bottom 0.406: IC1.2 138.43,59.69 v125.73,59.69
AH2J  (via drill 0.81)
  Top 0.406: IC1.22 134.62,76.2 134.62,102.23 135.89,103.5 v135.89,108.27 | v130.81,113.35 129.54,114.62 v129.54,116.84
  Bottom 0.406: v130.81,113.35 v135.89,108.27 | AX2.14 v129.54,116.84
AJ1J  (via drill 0.81)
  Top 0.406: IC1.1 140.97,57.15 140.97,53.02 141.92,52.07 145.73,52.07 v145.73,81.6
  Bottom 0.406: v145.73,81.6 145.73,99.69 126.36,99.69 AX1.16
AJ2J  (via drill 0.81)
  Top 0.406: v125.73,118.11 v125.73,96.84
  Bottom 0.406: IC1.21 132.4,76.52 138.43,76.52 139.38,77.47 140.02,77.47 142.88,80.33 142.88,93.98 128.59,93.98 v125.73,96.84 | AX2.16 v125.73,118.11
AK1J  (via drill 0.81)
  Top 0.406: AX1.18 v119.38,76.2
  Bottom 0.406: v119.38,76.2 IC2.8
AK2J  (via drill 0.81)
  Top 0.406: v123.19,77.47 123.19,104.78 122.56,105.41 120.65,105.41 120.65,120.02 119.38,121.28 AX2.18
  Bottom 0.406: IC2.21 110.49,77.47 v123.19,77.47
AL1J
  Top 0.406: IC2.7 115.57,74.93 115.57,102.87 AX1.20
AL2J  (via drill 0.81)
  Top 0.406: v114.94,73.66 116.2,72.39 118.11,72.39 118.11,115.25 116.84,116.52 AX2.20
  Bottom 0.406: v114.94,73.66 IC2.22
AM1J  (via drill 0.81)
  Top 0.406: v111.76,71.44 111.76,101.6 AX1.22
  Bottom 0.406: IC2.6 116.52,71.44 v111.76,71.44
AM2J  (via drill 0.81)
  Top 0.406: v145.73,113.35 144.46,114.62 v144.46,123.83
  Bottom 0.406: IC2.23 110.81,72.71 114.3,72.71 114.62,72.39 140.02,72.39 147,79.38 147,113.35 v145.73,113.35 | v144.46,123.83 140.34,127.95 131.13,127.95 128.27,125.09 128.27,123.19 115.57,123.19 AX2.22
AN1J  (via drill 0.81)
  Top 0.406: IC2.5 120.65,72.39 v120.65,102.23
  Bottom 0.406: v120.65,102.23 120.02,102.87 113.03,102.87 AX1.24
AN2J
  Top 0.406: IC2.24 110.49,69.85 110.49,120.65 AX2.24
AP1J  (via drill 0.81)
  Top 0.406: v102.87,108.27 v102.87,63.82
  Bottom 0.406: IC2.4 115.57,67.31 106.36,67.31 v102.87,63.82 | v102.87,108.27 102.87,105.41 107.95,105.41 AX1.26
AP2J
  Top 0.406: IC2.25 107.95,67.31 107.95,111.12 109.22,112.39 AX2.26
AR1J
  Top 0.406: IC2.3 110.49,63.5 110.49,63.82 109.54,64.77 104.78,64.77 104.78,102.23 AX1.28
AR2J
  Bottom 0.406: IC2.26 110.49,64.77 143.51,64.77 148.27,69.53 148.27,114.62 113.98,114.62 AX2.28
AS1J  (via drill 0.81)
  Top 0.406: v106.05,62.23 103.82,64.45 103.82,103.82 AX1.30
  Bottom 0.406: IC2.2 115.57,62.23 v106.05,62.23
AS2J  (via drill 0.81)
  Top 0.406: IC2.27 100.33,60.96 100.33,117.16 v99.69,117.79
  Bottom 0.406: v99.69,117.79 103.82,121.92 AX2.30
AT2J  (via drill 0.81)
  Top 0.406: v102.87,62.23 101.6,63.5 v101.6,94.61 | v95.89,99.69 92.71,102.87 92.71,111.76 89.85,114.62 v89.85,114.94
  Bottom 0.406: IC2.28 106.68,60.96 104.14,60.96 v102.87,62.23 | v101.6,94.61 96.52,99.69 v95.89,99.69 | v89.85,114.94 94.61,119.7 99.38,119.7 AX2.32
AU1J  (via drill 0.81)
  Top 0.406: v98.42,76.2 99.06,76.83 AX1.34
  Bottom 0.406: v98.42,76.2 IC3.8
AU2J  (via drill 0.81)
  Top 0.406: IC3.21 85.09,77.47 85.09,111.76 v89.85,116.52
  Bottom 0.406: v89.85,116.52 93.98,120.65 97.79,120.65 AX2.34
AV1J  (via drill 0.81)
  Top 0.406: v96.52,74.93 97.16,75.56 97.16,103.5 AX1.36
  Bottom 0.406: IC3.7 95.25,74.93 v96.52,74.93
AV2J  (via drill 0.81)
  Top 0.406: IC3.22 83.82,76.2 83.82,93.66 82.55,94.93 82.55,110.81 v89.85,118.11
  Bottom 0.406: v89.85,118.11 93.66,121.92 AX2.36
BA1J  (via drill 0.81)
  Top 0.406: v88.9,76.2 87.63,77.47 87.63,98.11 86.36,99.38 v86.36,102.23
  Bottom 0.406: v88.9,76.2 IC3.6 | v86.36,102.23 69.85,102.23 67.94,104.14 BX1.2
BA2J  (via drill 0.81)
  Top 0.813: v74.93,123.51 79.69,118.75 79.69,80.01 81.28,78.42 81.28,72.39 R15.1
  Bottom 0.813: IC3.23 R15.1 | BX2.2 65.09,123.51 v74.93,123.51
BB1J  (via drill 0.81)
  Top 0.406: v60.01,72.39 59.69,72.71 59.69,102.87 BX1.4
  Bottom 0.406: IC3.5 92.71,67.31 68.9,67.31 63.82,72.39 v60.01,72.39
BB2J  (via drill 0.81)
  Top 0.406: v73.03,69.85 73.34,70.17 73.34,88.27 71.44,90.17 69.85,90.17 69.85,100.97 70.17,101.28 v70.17,120.65
  Bottom 0.406: IC3.24 85.09,69.85 v73.03,69.85 | v70.17,120.65 62.23,120.65 BX2.4
BC1J  (via drill 0.81)
  Top 0.406: v76.2,64.77 74.3,66.67 74.3,94.61 71.44,97.47 v71.44,103.5
  Bottom 0.406: IC3.4 92.71,64.77 v76.2,64.77 | v71.44,103.5 69.53,105.41 59.69,105.41 BX1.6
BD1J  (via drill 0.81)
  Top 0.406: v65.41,62.23 60.64,62.23 56.52,66.36 56.52,80.64 56.2,80.96 56.2,103.82 BX1.8
  Bottom 0.406: IC3.3 92.71,62.23 v65.41,62.23
BD2J  (via drill 0.81)
  Top 0.406: IC3.26 90.49,67.63 90.49,107 v88.9,108.58
  Bottom 0.406: v88.9,108.58 81.92,115.57 62.87,115.57 56.52,121.92 BX2.8
BE1J  (via drill 0.81)
  Top 0.406: v61.91,59.69 55.56,66.04 55.56,80.33 55.24,80.64 55.24,102.23 BX1.10
  Bottom 0.406: IC3.2 87.95,60.96 86.68,59.69 v61.91,59.69
BE2J  (via drill 0.81)
  Top 0.406: IC3.27 91.44,66.04 v91.44,108.27
  Bottom 0.406: v91.44,108.27 84.45,115.25 84.45,128.27 85.41,128.27 86.36,129.22 86.36,130.81 60.33,130.81 54.61,125.09 54.61,121.92 BX2.10
BF1J  (via drill 0.81)
  Top 0.406: IC3.1 95.25,59.69 95.25,89.85 v95.57,90.17 | v51.75,90.17 50.8,91.12 BX1.12
  Bottom 0.406: v51.75,90.17 v95.57,90.17
BF2J  (via drill 0.81)
  Top 0.406: v67.94,57.15 67.63,57.47 67.63,74.93 65.09,77.47 65.09,95.25 66.04,96.2 v66.04,111.12
  Bottom 0.406: IC3.28 85.09,57.15 v67.94,57.15 | v66.04,111.12 56.52,120.65 52.07,120.65 BX2.12
BH1J  (via drill 0.81)
  Top 0.406: v67.63,102.87 v67.63,76.52
  Bottom 0.406: IC4.8 70.8,76.52 v67.63,76.52 | v67.63,102.87 49.53,102.87 BX1.14
BH2J  (via drill 0.81)
  Top 0.406: v54.29,78.74 54.29,101.28 52.07,103.5 52.07,104.78 51.44,105.41 46.99,105.41 46.99,120.65 BX2.14
  Bottom 0.406: IC4.21 60.96,78.74 v54.29,78.74
BJ1J  (via drill 0.81)
  Top 0.406: IC4.7 68.9,75.88 v68.9,101.6
  Bottom 0.406: v68.9,101.6 53.98,101.6 53.66,101.92 47.94,101.92 BX1.16
BJ2J  (via drill 0.81)
  Top 0.406: IC4.22 65.72,71.44 65.72,66.67 63.82,64.77 59.37,64.77 59.37,71.44 57.47,73.34 57.47,80.96 57.15,81.28 v57.15,117.47
  Bottom 0.406: v57.15,117.47 54.93,119.7 47.94,119.7 BX2.16
BK1J  (via drill 0.81)
  Top 0.406: v75.56,75.56 75.25,75.88 75.25,94.93 74.93,95.25 v74.93,99.38
  Bottom 0.406: v75.56,75.56 IC4.6 | v74.93,99.38 73.98,100.33 53.98,100.33 53.34,100.97 46.35,100.97 BX1.18
BK2J  (via drill 0.81)
  Top 0.406: IC4.23 64.77,69.85 64.77,68.26 63.82,67.31 61.28,67.31 61.28,93.98 62.23,94.93 v62.23,113.35
  Bottom 0.406: v62.23,113.35 59.37,116.2 48.9,116.2 BX2.18
BL1J  (via drill 0.81)
  Top 0.406: v54.29,74.93 53.02,76.2 v53.02,99.69
  Bottom 0.406: IC4.5 64.77,74.93 v54.29,74.93 | v53.02,99.69 52.7,100.01 44.77,100.01 BX1.20
BL2J  (via drill 0.81)
  Top 0.406: IC4.24 62.23,69.85 62.23,93.66 64.77,96.2 v64.77,109.22
  Bottom 0.406: v64.77,109.22 58.74,115.25 47.31,115.25 BX2.20
BM1J  (via drill 0.81)
  Top 0.406: v44.13,64.77 43.81,65.09 43.81,66.99 40.96,69.85 39.05,69.85 39.05,103.19 BX1.22
  Bottom 0.406: IC4.4 69.85,64.77 v44.13,64.77
BM2J  (via drill 0.81)
  Top 0.406: v32.07,67.31 31.75,67.63 v31.75,98.74
  Bottom 0.406: IC4.25 62.23,67.31 v32.07,67.31 | v31.75,98.74 35.88,102.87 36.2,102.87 36.83,103.5 36.83,121.92 BX2.22
BN1J  (via drill 0.81)
  Top 0.406: v35.56,62.23 35.88,62.55 35.88,82.87 35.24,83.5 35.24,103.82 BX1.24
  Bottom 0.406: IC4.3 65.09,63.5 63.82,62.23 v35.56,62.23
BN2J  (via drill 0.81)
  Top 0.406: IC4.26 66.67,63.5 66.67,60.01 63.82,57.15 58.42,57.15 58.42,57.47 51.12,64.77 49.53,64.77 49.53,63.18 48.58,62.23 45.09,62.23 45.09,64.14 46.04,65.09 46.04,101.92 44.45,103.5 v44.45,116.2
  Bottom 0.406: v44.45,116.2 39.37,121.28 39.37,123.19 36.83,123.19 BX2.24
BP1J  (via drill 0.81)
  Top 0.406: IC4.2 72.39,59.69 v72.39,53.98
  Bottom 0.406: v72.39,53.98 72.07,54.29 25.4,54.29 24.45,53.34 9.53,53.34 6.03,56.83 6.03,97.47 23.81,97.47 26.99,100.65 29.53,100.65 BX1.26
BP2J  (via drill 0.81)
  Top 0.406: v32.07,59.69 30.48,61.28 30.48,74.61 28.26,76.83 v28.26,101.92
  Bottom 0.406: IC4.27 49.85,60.96 48.58,59.69 v32.07,59.69 | v28.26,101.92 26.67,103.5 26.67,117.79 28.89,117.79 BX2.26
BR1J  (via drill 0.81)
  Top 0.406: IC4.1 70.48,57.78 v70.48,53.02 | v38.42,53.02 34.29,57.15 34.29,73.98 34.92,74.61 34.92,82.55 33.97,83.5 33.97,100.65 BX1.28
  Bottom 0.406: v38.42,53.02 v70.48,53.02
BR2J  (via drill 0.81)
  Top 0.406: v24.13,57.15 14.92,66.36 14.92,81.28 14.29,81.92 v14.29,113.98
  Bottom 0.406: IC4.28 62.23,57.15 v24.13,57.15 | v14.29,113.98 21.59,121.28 21.59,123.19 29.21,123.19 BX2.28
BS1J  (via drill 0.81)
  Top 0.406: v33.66,74.93 33.02,75.56 33.02,99.06 BX1.30
  Bottom 0.406: IC5.8 46.99,74.93 v33.66,74.93
BS2J  (via drill 0.81)
  Top 0.406: v28.57,74.93 26.67,76.83 26.67,120.02 27.94,121.28 BX2.30
  Bottom 0.406: IC5.21 32.07,76.2 30.8,74.93 v28.57,74.93
BT2J  (via drill 0.81)
  Top 0.406: v22.86,73.66 21.59,74.93 21.59,122.56 22.23,123.19 25.4,123.19 BX2.32
  Bottom 0.406: v22.86,73.66 IC5.22
BU1J  (via drill 0.81)
  Top 0.406: v24.13,72.39 24.13,102.87 BX1.34
  Bottom 0.406: IC5.6 46.99,72.39 v24.13,72.39
BU2J  (via drill 0.81)
  Top 0.406: IC5.23 41.91,72.39 41.91,104.78 41.27,105.41 29.21,105.41 29.21,117.79 v27.94,119.06 | v24.45,120.02 22.86,121.6 BX2.34
  Bottom 0.406: v27.94,119.06 26.99,120.02 v24.45,120.02
BV1J  (via drill 0.81)
  Top 0.406: v23.18,71.12 20.64,73.66 20.64,103.82 BX1.36
  Bottom 0.406: IC5.5 46.99,69.85 34.61,69.85 33.34,71.12 v23.18,71.12
BV2J  (via drill 0.81)
  Top 0.406: v8.57,67.31 8.26,67.63 v8.26,105.41
  Bottom 0.406: IC5.24 14.61,68.58 13.34,67.31 v8.57,67.31 | v8.26,105.41 8.26,121.92 BX2.36
CLK  (via drill 0.81)
  Top 0.406: v46.35,63.5 46.99,64.14 46.99,85.09 IC5.12
  Bottom 0.406: IC1.12 139.38,86.36 138.11,87.63 118.11,87.63 IC2.12 115.57,87.63 101.92,87.63 100.65,86.36 IC3.12 87.95,86.36 86.68,87.63 69.85,87.63 | IC5.12 61.91,86.36 63.18,87.63 69.85,87.63 | IC4.12 69.85,87.63 | PC1.7 13.97,64.77 42.55,64.77 43.81,63.5 v46.35,63.5
CS-N  (via drill 0.81)
  Top 0.406: v36.51,60.96 36.83,61.28 36.83,83.19 36.51,83.5 v36.51,84.77
  Bottom 0.406: 49.53,85.09 IC5.11 | 69.85,85.09 49.53,85.09 | IC4.11 69.85,85.09 | 92.71,85.09 IC3.11 | 69.85,85.09 92.71,85.09 | 115.57,85.09 IC2.11 | 92.71,85.09 115.57,85.09 | IC1.11 133.67,83.82 132.4,85.09 115.57,85.09 | v36.51,60.96 PC1.5 | v36.51,84.77 36.83,85.09 49.53,85.09
GND  (via drill 0.81)
  Top 0.813: GND.1 GND.2 GND.3 GND.4 GND.5 GND.6 GND.7 GND.8 v73.66,96.84 | IC5.7 49.85,75.25 49.85,79.69 IC5.10 | R20.1 v58.42,81.6 | BX1.32 v25.4,96.2 v25.4,78.74 | PC1.10 8.57,64.45 8.57,55.24 13.02,50.8 R13.1 | 80.17,62.71 78.74,61.28 C3.2 | 80.17,62.71 v83.5,66.04 | v77.79,80.01 80.01,77.79 80.01,62.87 80.17,62.71 | v106.05,81.28 106.68,81.92 R17.1 | IC1.10 140.97,82.55 140.97,83.19 141.29,83.5 v141.29,96.52 141.29,117.79 v139.7,119.38 | UUT.NC@2 UUT.NC@1 | UUT.NC@3 UUT.NC@4 UUT.NC@2 | UUT.NC@5 UUT.NC@6 27.94,7.3 27.94,6.67 14.92,6.67 14.29,7.3 UUT.NC@2 | GNDL2.1 R4.1 | GNDL1.1 R3.1 | GNDL0.1 R2.1 | C6.2 120.97,50.8 | 120.97,50.8 C5.2 118.11,57.15 IC2.1 116.84,58.74 121.92,63.82 C7.2 | GNDL3.1 R5.1 109.22,13.02 116.84,20.64 R11.1 120.97,22.86 | 120.97,22.86 R10.1 124.46,17.78 GNDPROBE.1 | 120.97,22.86 120.97,50.8 | R16.1 129.54,66.04 IC1.26 | v83.82,99.38 R18.1
  Bottom 0.813: BX2.6 60.96,119.38 GND.2 | BX1.32 23.81,102.55 19.68,102.55 17.14,105.09 17.14,112.71 12.38,112.71 10.16,114.94 POWER.2 | R18.1 82.23,96.84 v73.66,96.84 62.87,96.84 61.28,95.25 R19.1 R20.1 56.83,95.25 55.24,93.66 32.7,93.66 IC6.7 30.16,91.44 v25.4,96.2 | IC5.10 58.1,81.28 v58.42,81.6 | R13.1 R12.1 C2.2 R14.1 C4.2 C3.2 C5.2 | v83.5,66.04 IC3.25 | IC4.10 72.39,80.01 v77.79,80.01 | v106.05,81.28 IC3.10 | 128.11,96.68 126.68,98.11 109.54,98.11 108.74,97.31 | 128.11,96.68 R16.1 | R17.1 108.74,97.31 | v141.29,96.52 140.97,96.84 128.27,96.84 128.11,96.68 | 104.62,101.12 108.27,97.47 108.58,97.47 108.74,97.31 | 104.62,101.12 AX1.32 | AX2.6 137.16,119.38 v139.7,119.38 | C1.- 43.5,25.08 40.01,25.08 29.84,14.92 UUT.NC@8 29.84,11.75 29.53,11.75 UUT.NC@7 UUT.NC@6 | 49.69,6.51 55.88,12.7 R2.1 R3.1 R4.1 R5.1 | 49.69,6.51 GND0.1 | C7.2 IC2.10 | IC1.26 121.92,63.5 IC2.1 | UUT.NC@5 30.8,6.67 49.53,6.67 49.69,6.51 | v83.82,99.38 85.41,100.97 104.46,100.97 104.62,101.12 | IC6.13 v25.4,78.74
  pour Top (isolate 0.406): 152.4,152.4 0,152.4 0,0 152.4,0
  pour Bottom (isolate 0.406): 152.4,152.4 0,152.4 0,0 152.4,0
LED0
  Top 0.406: LED0.1 GREEN.A 54.61,19.05 54.61,52.07 IC5.1
LED1
  Top 0.406: LED1.1 RED1.A 69.85,19.05 69.85,39.37 IC5.2
LED2  (via drill 0.81)
  Top 0.406: LED2.1 YELLOW.A 85.09,19.05 85.09,29.21 v50.8,63.5
  Bottom 0.406: v50.8,63.5 IC5.3
LED3  (via drill 0.81)
  Top 0.406: RED2.A LED3.1 101.6,3.81 55.24,3.81 42.55,16.51 v42.55,66.04
  Bottom 0.406: v42.55,66.04 IC5.4
N$1
  Top 0.406: ECS.AA1 EDAC.AA1 DEC.AA1 138.43,138.11 138.43,107.95 AX1.1
N$2
  Top 0.406: EDAC.AV1 ECS.AV1
  Bottom 0.406: AX1.35 87.31,115.89 87.31,137.16 86.68,137.16 83.82,140.02 EDAC.AV1
N$3
  Top 0.406: ECS.AU1 EDAC.AU1 DEC.AU1 91.12,134.62 91.12,114.62 AX1.33
N$4  (via drill 0.81)
  Top 0.406: v92.39,115.89 92.08,116.2 92.08,138.11 90.17,140.02 EDAC.AT1 ECS.AT1
  Bottom 0.406: v92.39,115.89 AX1.31
N$5  (via drill 0.81)
  Top 0.406: ECS.AS1 EDAC.AS1 DEC.AS1 93.34,121.28 v98.11,116.52
  Bottom 0.406: AX1.29 104.14,116.52 v98.11,116.52
N$6
  Top 0.406: AX1.27 101.28,112.08 101.28,117.79 98.42,120.65 95.25,120.65 95.25,139.06 EDAC.AR1 ECS.AR1
N$7
  Top 0.406: ECS.AP1 EDAC.AP1 DEC.AP1
  Bottom 0.406: AX1.25 109.22,111.44 107.63,111.44 105.41,113.67 105.41,127 105.09,127 99.69,132.4 DEC.AP1
N$8  (via drill 0.81)
  Top 0.406: v106.68,117.47 102.87,121.28 EDAC.AN1 ECS.AN1
  Bottom 0.406: AX1.23 111.76,113.67 110.49,113.67 v106.68,117.47
N$9  (via drill 0.81)
  Top 0.406: ECS.AM1 EDAC.AM1 DEC.AM1 105.41,138.11 105.41,121.28 v107,119.7
  Bottom 0.406: AX1.21 114.3,113.67 113.03,113.67 v107,119.7
N$10
  Top 0.406: AX1.19 113.03,110.49 113.03,122.56 112.39,123.19 110.49,123.19 110.49,129.22 109.54,130.18 109.54,140.02 EDAC.AL1 ECS.AL1
N$11  (via drill 0.81)
  Top 0.406: ECS.AK1 EDAC.AK1 DEC.AK1 | AX1.17 119.06,107 v119.06,115.89
  Bottom 0.406: v119.06,115.89 114.3,120.65 111.12,120.65 110.49,121.28 110.49,127 110.17,127 107,130.18 107,135.25 108.9,135.25 DEC.AK1
N$12
  Top 0.406: AX1.15 121.6,107 121.6,120.33 120.65,121.28 120.65,122.56 120.02,123.19 115.57,123.19 EDAC.AJ1 ECS.AJ1
N$13  (via drill 0.81)
  Top 0.406: ECS.AH1 EDAC.AH1 DEC.AH1 | AX1.13 124.46,120.02 125.73,121.28 v125.73,131.76
  Bottom 0.406: DEC.AH1 v125.73,131.76
N$14  (via drill 0.81)
  Top 0.406: v123.19,110.49 123.19,139.06 EDAC.AF1 ECS.AF1
  Bottom 0.406: v123.19,110.49 AX1.11
N$15
  Top 0.406: ECS.AE1 EDAC.AE1 DEC.AE1 128.27,135.57 128.27,107.95 AX1.9
N$16  (via drill 0.81)
  Top 0.406: AX1.7 133.35,107.95 v133.35,134.94 | EDAC.AD1 ECS.AD1
  Bottom 0.406: v133.35,134.94 128.27,140.02 EDAC.AD1
N$17  (via drill 0.81)
  Top 0.406: ECS.AC1 EDAC.AC1 DEC.AC1 | v134.62,115.89 AX1.5
  Bottom 0.406: v134.62,115.89 147.32,115.89 149.54,118.11 149.54,137.16 133.03,137.16 DEC.AC1
N$18
  Top 0.406: AX1.3 137.16,120.02 135.89,121.28 135.89,137.48 134.62,138.75 EDAC.AB1 ECS.AB1
N$19
  Top 0.406: AX2.1 139.38,124.78 139.38,143.51 ECS.AA2 EDAC.AA2
N$20
  Top 0.406: DEC.AB2 EDAC.AB2 ECS.AB2 136.21,143.51 136.21,138.43 136.84,137.79 136.84,124.78 AX2.3
N$21
  Top 0.406: AX2.5 134.62,137.48 133.03,139.06 133.03,143.51 ECS.AC2 EDAC.AC2
N$22
  Top 0.406: DEC.AD2 EDAC.AD2 ECS.AD2 129.86,143.51 129.86,138.43 130.18,138.11 130.18,126.36 AX2.7
N$23
  Top 0.406: AX2.9 129.22,124.78 129.22,137.48 126.68,140.02 126.68,143.51 ECS.AE2 EDAC.AE2
N$24
  Top 0.406: DEC.AF2 EDAC.AF2 ECS.AF2
  Bottom 0.406: AX2.11 127,137.16 124.78,137.16 123.51,138.43 123.51,145.1 ECS.AF2
N$25
  Top 0.406: ECS.AH2 EDAC.AH2
  Bottom 0.406: AX2.13 117.16,131.76 117.16,145.1 ECS.AH2
N$26
  Top 0.406: DEC.AJ2 EDAC.AJ2 ECS.AJ2 117.16,143.51 117.16,129.22 AX2.15
N$27
  Top 0.406: ECS.AK2 EDAC.AK2
  Bottom 0.406: AX2.17 119.38,128.27 113.98,133.67 113.98,145.1 ECS.AK2
N$28  (via drill 0.81)
  Top 0.406: DEC.AL2 EDAC.AL2 ECS.AL2 110.81,143.51 v110.81,130.49
  Bottom 0.406: v110.81,130.49 AX2.19
N$29  (via drill 0.81)
  Top 0.406: v108.27,130.49 107.95,130.81 107.95,139.7 107.63,140.02 107.63,143.51 ECS.AM2 EDAC.AM2
  Bottom 0.406: v108.27,130.49 AX2.21
N$30
  Top 0.406: ECS.AN2 EDAC.AN2 DEC.AN2 102.87,149.86 111.12,149.86 113.98,147 113.98,126.68 AX2.23
N$31  (via drill 0.81)
  Top 0.406: v101.28,132.4 101.28,142.24 99.69,143.83 ECS.AP2 EDAC.AP2
  Bottom 0.406: v101.28,132.4 AX2.25
N$32  (via drill 0.81)
  Top 0.406: DEC.AR2 EDAC.AR2 ECS.AR2 | v106.68,136.53 AX2.27
  Bottom 0.406: v106.68,136.53 106.05,137.16 104.14,137.16 101.28,140.02 101.28,143.51 98.11,143.51 ECS.AR2
N$33
  Top 0.406: AX2.29 104.46,124.78 104.46,142.24 103.19,143.51 101.28,143.51 101.28,147 98.42,149.86 93.34,149.86 EDAC.AS2 ECS.AS2
N$34
  Top 0.406: DEC.AT2 EDAC.AT2 ECS.AT2
  Bottom 0.406: AX2.31 101.6,128.91 100.01,128.91 94.93,133.99 94.93,143.51 91.76,143.51 ECS.AT2
N$35
  Top 0.406: ECS.AU2 EDAC.AU2
  Bottom 0.406: AX2.33 99.06,128.27 91.76,135.57 91.76,142.56 91.44,142.56 90.49,143.51 88.58,143.51 ECS.AU2
N$36
  Top 0.406: DEC.AV2 EDAC.AV2 ECS.AV2 83.82,143.51 96.84,143.51 98.11,142.24 98.11,126.05 AX2.35
N$37  (via drill 0.81)
  Top 0.406: v66.36,127.32 66.36,143.51 ECS.BA2 EDAC.BA2
  Bottom 0.406: v66.36,127.32 BX2.1
N$38
  Top 0.406: DEC.BB2 EDAC.BB2 ECS.BB2 63.18,143.51 63.18,126.68 BX2.3
N$39
  Top 0.406: BX2.5 58.74,124.78 58.74,137.79 60.01,139.06 60.01,143.51 ECS.BC2 EDAC.BC2
N$40
  Top 0.406: DEC.BD2 EDAC.BD2 ECS.BD2 56.83,143.51 56.83,138.43 56.2,137.79 56.2,124.78 BX2.7
N$41
  Top 0.406: BX2.9 53.66,124.78 53.66,143.51 ECS.BE2 EDAC.BE2
N$42
  Top 0.406: DEC.BF2 EDAC.BF2 ECS.BF2
  Bottom 0.406: BX2.11 50.8,139.7 50.48,140.02 50.48,145.1 ECS.BF2
N$43
  Top 0.406: BX2.13 50.48,126.68 50.48,143.51 ECS.BH2 EDAC.BH2
N$44
  Top 0.406: DEC.BJ2 EDAC.BJ2 ECS.BJ2 47.31,143.51 47.31,139.06 46.04,137.79 46.04,124.78 BX2.15
N$45
  Top 0.406: BX2.17 43.5,124.78 43.5,137.79 44.13,138.43 44.13,143.51 ECS.BK2 EDAC.BK2
N$46
  Top 0.406: DEC.BL2 EDAC.BL2 ECS.BL2 40.96,143.51 40.96,124.78 BX2.19
N$47
  Top 0.406: BX2.21 37.78,124.78 37.78,143.51 ECS.BM2 EDAC.BM2
N$48
  Top 0.406: DEC.BN2 EDAC.BN2 ECS.BN2 34.61,143.51 34.61,138.43 35.24,137.79 35.24,124.78 BX2.23
N$49
  Top 0.406: BX2.25 32.7,124.78 32.7,137.79 31.43,139.06 31.43,143.51 ECS.BP2 EDAC.BP2
N$50
  Top 0.406: DEC.BR2 EDAC.BR2 ECS.BR2 28.26,143.51 28.26,138.43 30.16,136.53 30.16,124.78 BX2.27
N$51
  Top 0.406: BX2.29 25.08,127.32 25.08,143.51 ECS.BS2 EDAC.BS2
N$52
  Top 0.406: DEC.BT2 EDAC.BT2 ECS.BT2 21.91,143.51 21.91,127.95 BX2.31
N$53
  Top 0.406: ECS.BU2 EDAC.BU2
  Bottom 0.406: BX2.33 22.86,137.48 21.27,137.48 18.73,140.02 18.73,145.1 ECS.BU2
N$54
  Top 0.406: DEC.BV2 EDAC.BV2 ECS.BV2
  Bottom 0.406: BX2.35 20.32,137.16 16.83,137.16 15.56,138.43 15.56,145.1 ECS.BV2
N$55
  Top 0.406: ECS.BA1 EDAC.BA1 DEC.BA1 67.94,123.19 63.5,118.75 BX1.1
N$56
  Top 0.406: BX1.3 60.96,117.47 64.77,121.28 EDAC.BB1 ECS.BB1
N$57
  Top 0.406: ECS.BC1 EDAC.BC1 DEC.BC1 59.69,136.84 59.69,107.95 BX1.5
N$58
  Top 0.406: BX1.7 55.88,120.02 57.15,121.28 57.15,137.48 58.42,138.75 EDAC.BD1 ECS.BD1
N$59
  Top 0.406: ECS.BE1 EDAC.BE1 DEC.BE1 54.61,138.11 54.61,107.95 BX1.9
N$60
  Top 0.406: BX1.11 52.07,107.95 EDAC.BF1 ECS.BF1
N$61
  Top 0.406: ECS.BH1 EDAC.BH1 DEC.BH1 46.99,136.84 46.99,123.19 48.9,123.19 49.53,122.56 49.53,107.95 BX1.13
N$62
  Top 0.406: BX1.15 45.72,120.02 44.45,121.28 44.45,137.48 45.72,138.75 EDAC.BJ1 ECS.BJ1
N$63
  Top 0.406: ECS.BK1 EDAC.BK1 DEC.BK1 41.91,138.11 41.91,107.95 BX1.17
N$64
  Top 0.406: BX1.19 39.37,107.95 EDAC.BL1 ECS.BL1
N$65
  Top 0.406: ECS.BM1 EDAC.BM1 DEC.BM1 36.83,138.11 36.83,107.95 BX1.21
N$66
  Top 0.406: BX1.23 34.29,107.95 34.29,137.48 33.02,138.75 EDAC.BN1 ECS.BN1
N$67
  Top 0.406: ECS.BP1 EDAC.BP1 DEC.BP1 31.75,136.84 31.75,107.95 BX1.25
N$68
  Top 0.406: BX1.27 30.16,107 30.16,120.33 29.21,121.28 29.21,136.21 26.67,138.75 EDAC.BR1 ECS.BR1
N$69
  Top 0.406: ECS.BS1 EDAC.BS1 DEC.BS1
  Bottom 0.406: BX1.29 27.94,116.84 29.84,116.84 34.29,121.28 34.29,137.16 25.08,137.16 DEC.BS1
N$70  (via drill 0.81)
  Top 0.406: v19.05,113.03 19.05,139.06 EDAC.BT1 ECS.BT1
  Bottom 0.406: v19.05,113.03 BX1.31
N$71  (via drill 0.81)
  Top 0.406: ECS.BU1 EDAC.BU1 DEC.BU1 17.14,112.39 v18.41,111.12
  Bottom 0.406: v18.41,111.12 BX1.33
N$72
  Top 0.406: BX1.35 15.56,111.44 15.56,138.75 EDAC.BV1 ECS.BV1
N$73
  Bottom 0.406: GREEN.K 58.42,22.86 R2.2
N$74
  Bottom 0.406: RED1.K 73.66,22.86 R3.2
N$75
  Bottom 0.406: YELLOW.K 88.9,22.86 R4.2
N$76
  Bottom 0.406: RED2.K 104.14,22.86 R5.2
N$77
  Top 0.406: R7.1 R6.1 LOADL3.1
N$78
  Top 0.406: R9.1 R8.1 LOADL1.1
N$79
  Top 0.406: LOADHI1.1 R11.2
N$80
  Top 0.406: LOADHI3.1 R10.2
N$81
  Top 0.406: D2.A D1.C
N$82
  Top 0.406: UUT_PWR.K 17.78,25.4 R13.2 R12.2
N$83
  Bottom 0.406: PWR.K 35.56,40.64 R14.2
PROBE1  (via drill 0.81)
  Top 0.406: v29.21,66.04 29.53,65.72 29.53,51.75 v41.27,40.01
  Bottom 0.406: v29.21,66.04 IC5.25 | v41.27,40.01 53.34,27.94 142.24,27.94 PROBE1.1
PROBE2  (via drill 0.81)
  Top 0.406: IC5.26 39.37,62.23 39.37,53.66 40.01,53.02 v40.01,42.86
  Bottom 0.406: v40.01,42.86 49.85,33.02 PROBE2.1
PROBE3  (via drill 0.81)
  Top 0.406: v43.81,60.96 51.12,53.66 v51.12,40.64
  Bottom 0.406: v43.81,60.96 IC5.27 | PROBE3.1 v51.12,40.64
PROBE4  (via drill 0.81)
  Top 0.406: IC5.28 41.27,57.78 v41.27,49.53
  Bottom 0.406: v41.27,49.53 143.51,49.53 PROBE4.1
RESET-N  (via drill 0.81)
  Top 0.406: v35.56,58.42 37.78,60.64 v37.78,83.82
  Bottom 0.406: 107.95,82.55 87.63,82.55 IC3.18 85.09,82.55 66.99,82.55 65.72,83.82 IC4.18 59.05,83.82 57.78,82.55 41.91,82.55 IC5.18 v37.78,83.82 | IC2.18 107.95,82.55 | IC1.18 130.81,82.55 107.95,82.55 | v35.56,58.42 PC1.3
SI-A  (via drill 0.81)
  Top 0.406: v135.89,100.97 v135.89,91.44 | v107.95,112.71 100.33,120.33 v100.33,130.18 | v12.38,149.86 2.22,139.7 2.22,62.23 v7.3,57.15
  Bottom 0.406: IC1.13 137.16,91.44 v135.89,91.44 | v135.89,100.97 135.57,101.28 127.95,101.28 125.73,103.5 125.73,105.41 111.12,105.41 110.49,106.05 110.49,112.71 v107.95,112.71 | v100.33,130.18 98.11,132.4 98.11,142.56 97.79,142.56 96.84,143.51 96.2,143.51 94.93,144.78 94.93,149.86 v12.38,149.86 | v7.3,57.15 10.79,57.15 11.43,57.78 11.43,66.04 PC1.9
SI-B  (via drill 0.81)
  Top 0.406: v19.37,75.25 v19.37,90.17
  Bottom 0.406: IC2.13 116.52,89.22 113.03,89.22 108.9,93.34 56.52,93.34 54.61,91.44 49.85,91.44 48.58,90.17 v19.37,90.17 | PC1.11 v19.37,75.25
SI-C  (via drill 0.81)
  Top 0.406: IC3.13 92.39,87.31 v92.39,59.69 | v24.13,54.61 13.97,64.77 13.97,69.85 PC1.13
  Bottom 0.406: v92.39,59.69 87.95,55.24 24.77,55.24 v24.13,54.61
SI-D  (via drill 0.81)
  Top 0.406: IC4.13 72.39,87.63 72.39,70.8 71.44,69.85 69.22,69.85 v69.22,48.26 | v21.27,48.26 19.05,50.48 19.05,56.52 13.34,62.23 11.43,62.23 11.43,72.39 PC1.15
  Bottom 0.406: v21.27,48.26 v69.22,48.26
SI-E  (via drill 0.81)
  Top 0.406: v44.77,77.47 v44.77,88.9
  Bottom 0.406: v44.77,88.9 IC5.13 | v44.77,77.47 13.97,77.47 PC1.17
SO-A  (via drill 0.81)
  Top 0.406: v33.02,69.85 33.34,69.53 33.34,52.07 38.73,46.67 v38.73,45.72 | v122.24,41.91 137.79,57.47 v137.79,73.66 | R16.2 IC1.14
  Bottom 0.406: IC6.1 26.99,76.2 25.72,74.93 22.54,74.93 21.59,73.98 21.59,69.85 v33.02,69.85 | v38.73,45.72 42.55,41.91 v122.24,41.91 | v137.79,73.66 139.06,74.93 140.02,74.93 144.46,79.38 144.46,95.25 R16.2
SO-AN
  Bottom 0.406: IC6.2 29.21,80.01 21.91,80.01 18.41,83.5 14.29,83.5 13.34,82.55 9.53,82.55 7.3,80.33 7.3,58.42 PC1.4
SO-B
  Bottom 0.406: IC6.3 31.75,80.01 66.36,80.01 68.9,77.47 106.36,77.47 108.9,74.93 129.22,74.93 131.76,77.47 133.03,77.47 135.57,80.01 140.02,80.01 141.92,81.92 141.92,92.71 116.84,92.71 | IC2.14 116.84,92.71 | 116.84,92.71 R17.2
SO-BN
  Bottom 0.406: IC6.4 29.21,85.09 13.97,85.09 PC1.25
SO-C  (via drill 0.81)
  Top 0.406: IC6.5 29.21,87.63 29.21,92.08 v30.48,93.34 | R18.2 IC3.14
  Bottom 0.406: v30.48,93.34 35.24,98.11 91.12,98.11 R18.2
SO-CN
  Bottom 0.406: IC6.6 29.21,87.63 12.06,87.63 11.43,87 11.43,83.82 PC1.23
SO-D  (via drill 0.81)
  Top 0.406: v75.25,107.95 76.2,107 v76.2,95.57 | R19.2 IC4.14
  Bottom 0.406: IC6.9 19.05,88.9 18.1,89.85 18.1,96.52 24.13,96.52 25.08,97.47 33.34,97.47 39.37,103.5 39.37,107.95 v75.25,107.95 | v76.2,95.57 75.88,95.25 R19.2
SO-DN  (via drill 0.81)
  Top 0.406: v19.37,91.76 18.1,90.49 v18.1,82.23
  Bottom 0.406: IC6.8 22.54,91.76 v19.37,91.76 | v18.1,82.23 14.61,78.74 PC1.19
SO-E  (via drill 0.81)
  Top 0.406: v49.85,87.63 49.53,87.95 49.53,90.17 IC5.14 R20.2
  Bottom 0.406: IC6.11 24.13,82.55 32.7,82.55 37.78,87.63 v49.85,87.63
SO-EN  (via drill 0.81)
  Top 0.406: v15.56,82.23 v15.56,86.36
  Bottom 0.406: v15.56,86.36 IC6.10 | v15.56,82.23 14.61,81.28 PC1.21
VCC  (via drill 0.81)
  Top 0.813: 25.4,67.31 D1.A 25.4,45.4 23.81,43.81 23.81,12.38 UUT.2 | 25.4,67.31 v25.4,76.2 | v15.88,105.41 16.83,104.46 16.83,75.56 25.08,67.31 25.4,67.31
  Bottom 0.813: v25.4,76.2 IC6.14 | v15.88,105.41 10.16,111.12 POWER.3
VDD  (via drill 0.81)
  Top 0.813: IC1.17 IC1.16 IC1.15 | v135.89,85.09 v135.89,78.74 | IC2.17 IC2.16 IC2.15 | v113.03,86.36 114.3,85.09 v114.3,80.96 | C6.1 127,48.26 C7.1 v127,86.36 | IC3.17 IC3.16 IC3.15 | v89.22,81.28 88.9,81.6 v88.9,87.63 | IC5.15 IC5.16 IC5.17 | v43.5,78.74 43.18,79.06 v43.18,86.36 | D2.C 30.64,43.02 | 30.64,43.02 PWR.A | C2.1 30.8,43.5 30.8,43.18 30.64,43.02 | IC4.17 IC4.16 IC4.15 | 75.41,49.37 72.39,46.35 C4.1 | 75.41,49.37 77.47,51.44 77.47,77.79 v76.52,78.74 76.52,84.45 v78.42,86.36 | C3.1 75.56,48.9 75.56,49.21 75.41,49.37 | v66.36,81.6 v66.36,86.36 | v51.12,78.74 51.75,79.38 v51.75,87.63
  Bottom 0.813: v135.89,78.74 IC1.9 | v135.89,85.09 134.62,86.36 IC1.17 v127,86.36 | C6.1 C5.1 C3.1 | C7.1 125.41,79.69 117.79,79.69 IC2.9 116.52,78.74 v114.3,80.96 | v113.03,86.36 IC2.17 | IC3.9 91.44,81.28 v89.22,81.28 | v88.9,87.63 87.63,88.9 IC3.16 | v43.5,78.74 IC5.9 v51.12,78.74 | IC5.17 v43.18,86.36 | v76.52,78.74 IC4.9 69.22,78.74 v66.36,81.6 | v66.36,86.36 IC4.17 | C2.1 34.29,46.99 71.12,46.99 C4.1 | v51.75,87.63 53.02,88.9 IC4.16 | v78.42,86.36 IC3.17
VPP  (via drill 0.81)
  Top 0.813: C1.+ 40.64,14.29 | 40.64,14.29 VPP0.1 | 40.64,14.29 25.08,14.29 25.08,8.89 UUT.3 | R1.2 142.24,82.55 142.56,82.87 142.56,119.06 141.13,120.49 | AX2.2 141.13,120.49 | 141.13,120.49 141.29,120.65 141.29,151.13 84.45,151.13 82.23,148.91 82.23,123.19 81.28,122.24 VPP.1 VPP.2 VPP.3 VPP.4 VPP.5 VPP.6 VPP.7 VPP.8 81.28,82.55 R15.2 82.55,75.88 84.77,73.66 84.77,58.1 86.36,56.52 v86.36,26.67
  Bottom 0.813: UUT_PWR.A 24.77,10.79 24.77,8.89 UUT.3 | C1.+ 47.31,16.19 75.88,16.19 v86.36,26.67 125.73,26.67 R9.2 R8.2 R7.2 R6.2

### Text on the board
Top: - | ON
tPlace: BV | BA | AV | AA | M-Series Flip-Chip Tester | Design by Warren Stearns | Revision B